# EAGLE design LinuxBoard_v1.6 (EAGLE 7.2.0)
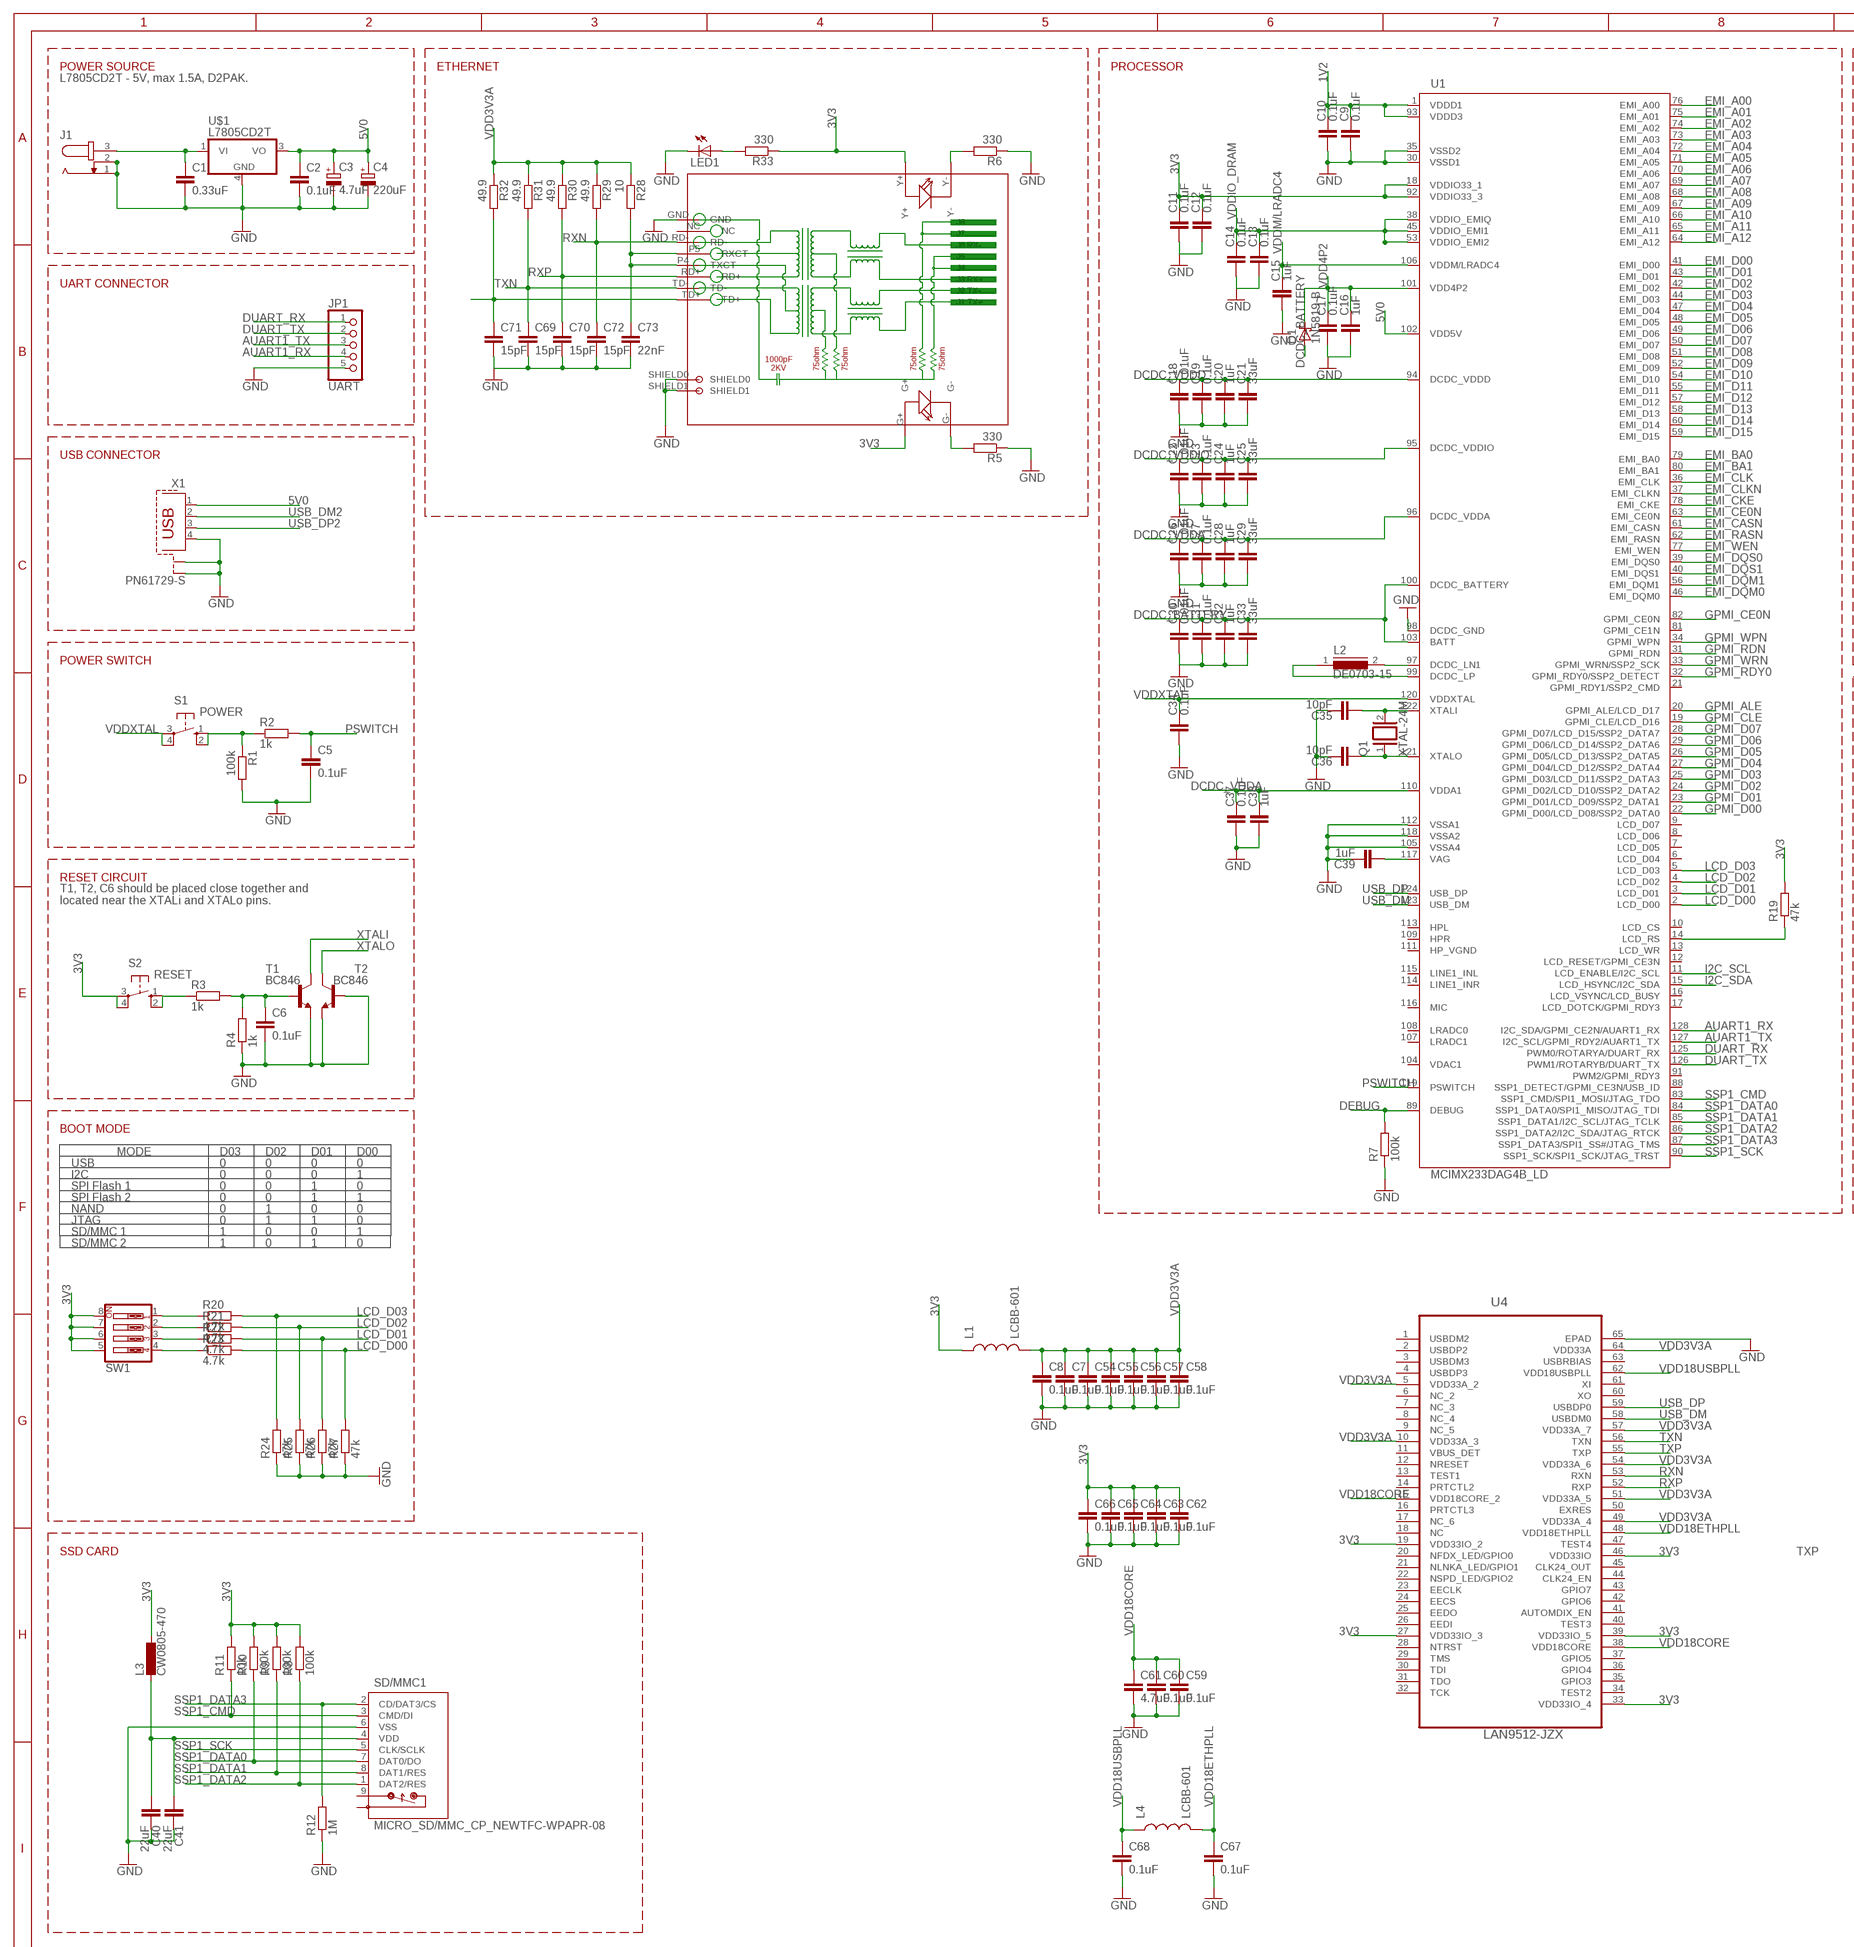
[diagram p0: schematic, sheet 1, part 1 of 2]
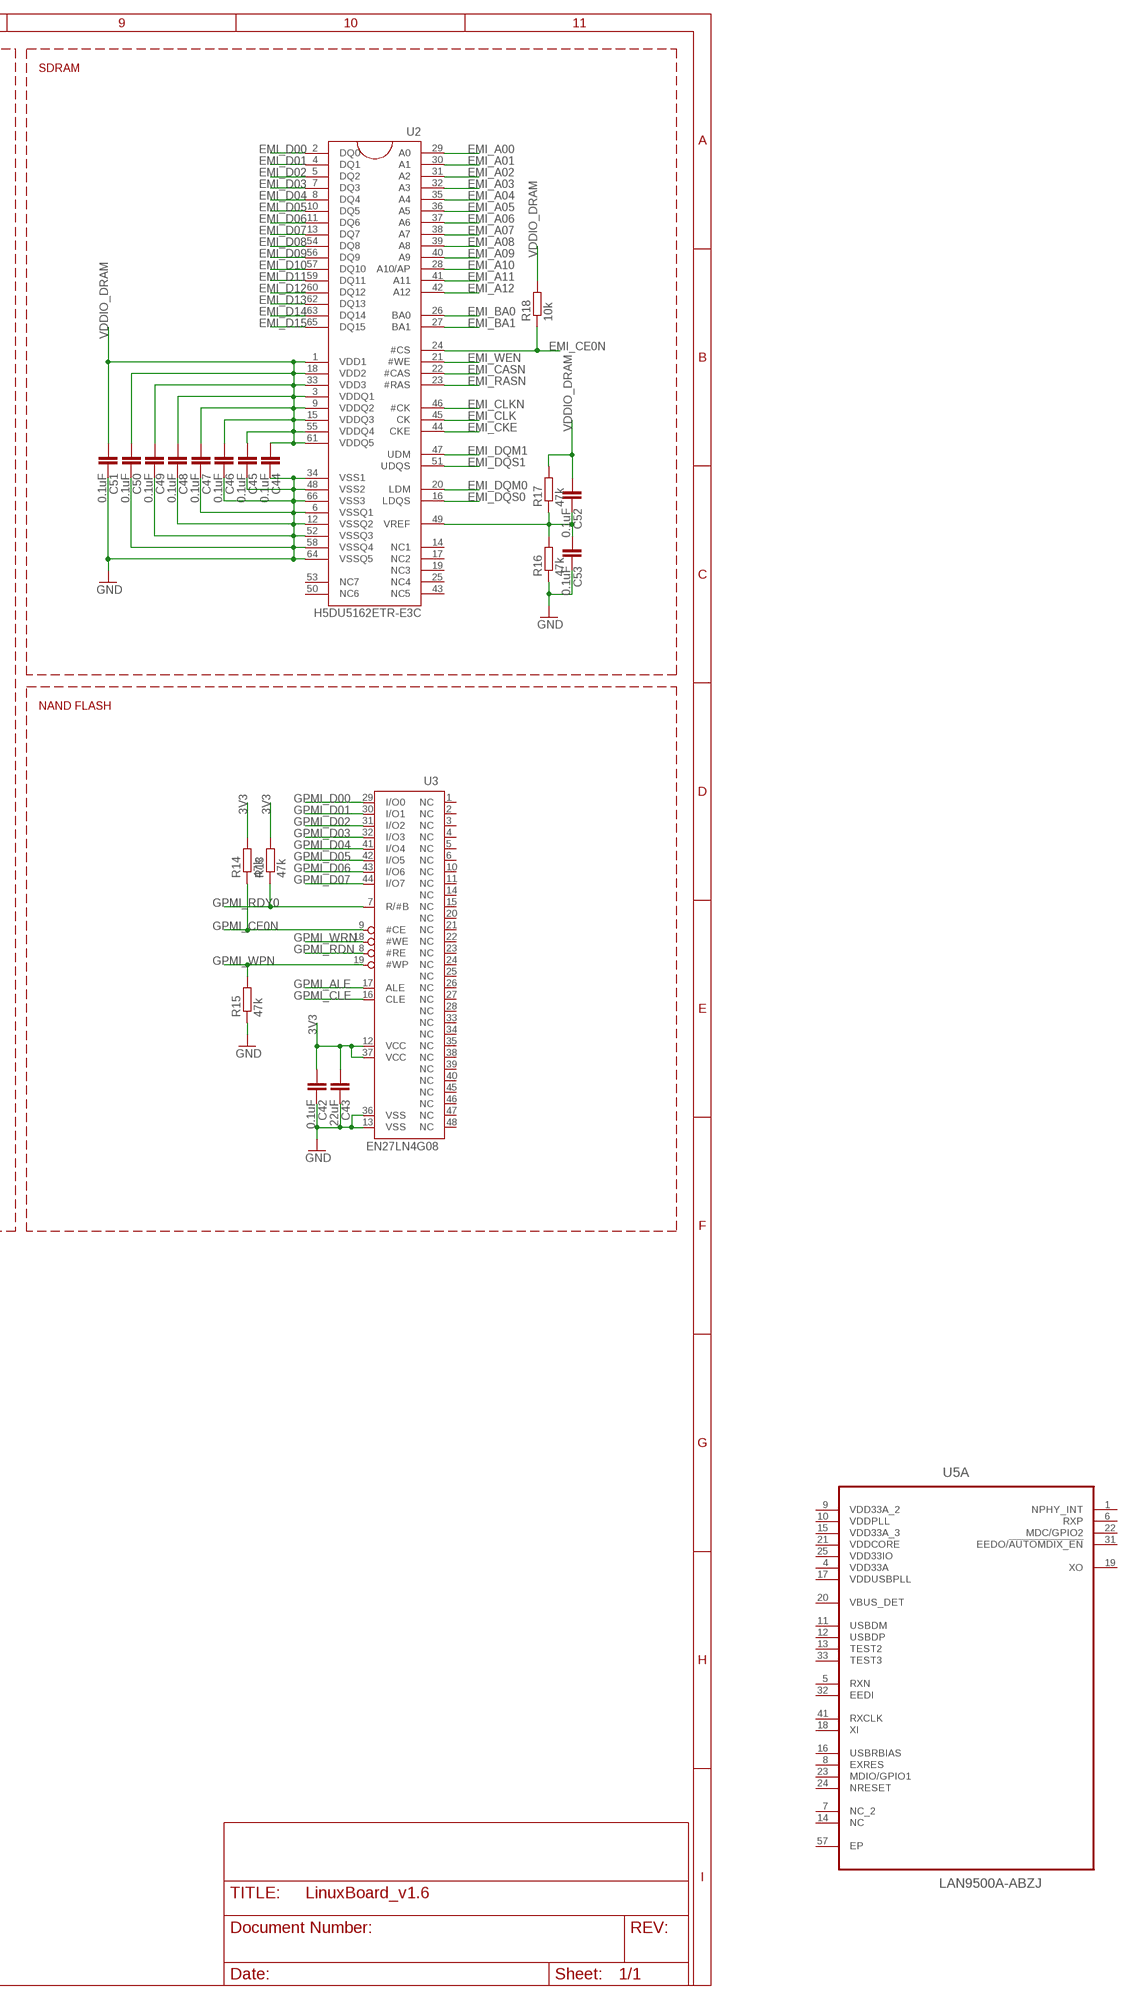
[diagram p1: schematic, sheet 1, part 2 of 2]

## Parts
C1  0.33uF  C-EUC0805  [C0805]
C2  0.1uF  C-EUC0805  [C0805]
C3  4.7uF  CPOL-EUE2-5  [E2-5]
C4  220uF  CPOL-EUE2-5  [E2-5]
C5  0.1uF  C-EUC0805  [C0805]
C6  0.1uF  C-EUC0805  [C0805]
C7  0.1uF  C-EUC0805  [C0805]
C8  0.1uF  C-EUC0805  [C0805]
C9  0.1uF  C-EUC0805  [C0805]
C10  0.1uF  C-EUC0805  [C0805]
C11  0.1uF  C-EUC0805  [C0805]
C12  0.1uF  C-EUC0805  [C0805]
C13  0.1uF  C-EUC0805  [C0805]
C14  0.1uF  C-EUC0805  [C0805]
C15  1uF  C-EUC0805  [C0805]
C16  1uF  C-EUC0805  [C0805]
C17  0.1uF  C-EUC0805  [C0805]
C18  0.01uF  C-EUC0805  [C0805]
C19  0.1uF  C-EUC0805  [C0805]
C20  1uF  C-EUC0805  [C0805]
C21  33uF  C-EUC0805  [C0805]
C22  0.01uF  C-EUC0805  [C0805]
C23  0.1uF  C-EUC0805  [C0805]
C24  1uF  C-EUC0805  [C0805]
C25  33uF  C-EUC0805  [C0805]
C26  0.01uF  C-EUC0805  [C0805]
C27  0.1uF  C-EUC0805  [C0805]
C28  1uF  C-EUC0805  [C0805]
C29  33uF  C-EUC0805  [C0805]
C30  0.01uF  C-EUC0805  [C0805]
C31  0.1uF  C-EUC0805  [C0805]
C32  1uF  C-EUC0805  [C0805]
C33  33uF  C-EUC0805  [C0805]
C34  0.1uF  C-EUC0805  [C0805]
C35  10pF  C-EUC0805  [C0805]
C36  10pF  C-EUC0805  [C0805]
C37  0.1uF  C-EUC0805  [C0805]
C38  1uF  C-EUC0805  [C0805]
C39  1uF  C-EUC0805  [C0805]
C40  22uF  C-EUC0805  [C0805]
C41  22uF  C-EUC0805  [C0805]
C42  0.1uF  C-EUC0805  [C0805]
C43  22uF  C-EUC0805  [C0805]
C44  0.1uF  C-EUC0805  [C0805]
C45  0.1uF  C-EUC0805  [C0805]
C46  0.1uF  C-EUC0805  [C0805]
C47  0.1uF  C-EUC0805  [C0805]
C48  0.1uF  C-EUC0805  [C0805]
C49  0.1uF  C-EUC0805  [C0805]
C50  0.1uF  C-EUC0805  [C0805]
C51  0.1uF  C-EUC0805  [C0805]
C52  0.1uF  C-EUC0805  [C0805]
C53  0.1uF  C-EUC0805  [C0805]
C54  0.1uF  C-EUC0805  [C0805]
C55  0.1uF  C-EUC0805  [C0805]
C56  0.1uF  C-EUC0805  [C0805]
C57  0.1uF  C-EUC0805  [C0805]
C58  0.1uF  C-EUC0805  [C0805]
C59  0.1uF  C-EUC0805  [C0805]
C60  0.1uF  C-EUC0805  [C0805]
C61  4.7uF  C-EUC0805  [C0805]
C62  0.1uF  C-EUC0805  [C0805]
C63  0.1uF  C-EUC0805  [C0805]
C64  0.1uF  C-EUC0805  [C0805]
C65  0.1uF  C-EUC0805  [C0805]
C66  0.1uF  C-EUC0805  [C0805]
C67  0.1uF  C-EUC0805  [C0805]
C68  0.1uF  C-EUC0805  [C0805]
C69  15pF  C-EUC0805  [C0805]
C70  15pF  C-EUC0805  [C0805]
C71  15pF  C-EUC0805  [C0805]
C72  15pF  C-EUC0805  [C0805]
C73  22nF  C-EUC0805  [C0805]
D1  1N5819-B  [DO41-7.6]
J1  JACK-PLUG0  [SPC4077]
JP1  UART  PINHD-1X5  [1X05]
L1  LCBB-601  INDUCTOR0805  [0805]
L2  DE0703-15  DR73  [DR73]
L3  CW0805-470  L-EUL2012C  [L2012C]
L4  LCBB-601  INDUCTOR0805  [0805]
LED1  LEDSML0805  [SML0805]
Q1  XTAL-24M  XTAL/S  [QS]
R1  100k  R-EU_R0805  [R0805]
R2  1k  R-EU_R0805  [R0805]
R3  1k  R-EU_R0805  [R0805]
R4  1k  R-EU_R0805  [R0805]
R5  330  R-EU_R0805  [R0805]
R6  330  R-EU_R0805  [R0805]
R7  100k  R-EU_R0805  [R0805]
R8  100k  R-EU_R0805  [R0805]
R9  100k  R-EU_R0805  [R0805]
R10  100k  R-EU_R0805  [R0805]
R11  10k  R-EU_R0805  [R0805]
R12  1M  R-EU_R0805  [R0805]
R13  47k  R-EU_R0805  [R0805]
R14  47k  R-EU_R0805  [R0805]
R15  47k  R-EU_R0805  [R0805]
R16  47k  R-EU_R0805  [R0805]
R17  47k  R-EU_R0805  [R0805]
R18  10k  R-EU_R0805  [R0805]
R19  47k  R-EU_R0805  [R0805]
R20  4.7k  R-EU_R0805  [R0805]
R21  4.7k  R-EU_R0805  [R0805]
R22  4.7k  R-EU_R0805  [R0805]
R23  4.7k  R-EU_R0805  [R0805]
R24  47k  R-EU_R0805  [R0805]
R25  47k  R-EU_R0805  [R0805]
R26  47k  R-EU_R0805  [R0805]
R27  47k  R-EU_R0805  [R0805]
R28  10  R-EU_R0805  [R0805]
R29  49.9  R-EU_R0805  [R0805]
R30  49.9  R-EU_R0805  [R0805]
R31  49.9  R-EU_R0805  [R0805]
R32  49.9  R-EU_R0805  [R0805]
R33  330  R-EU_R0805  [R0805]
RJ1  HR911105A  [HR911105A]
S1  POWER  10-XX  [B3F-10XX]
S2  RESET  10-XX  [B3F-10XX]
SD/MMC1  MICRO_SD/MMC_CP_NEWTFC-WPAPR-08  [TFC-WPAPR-08]
SW1  SW_DIP-4  [EDG-04]
T1  BC846  [SOT23]
T2  BC846  [SOT23]
U1  MCIMX233DAG4B_LD  [TQFP128LD]
U2  H5DU5162ETR-E3C  HY5DU121622D(L)T(P)-J  [66TSOP-II]
U3  EN27LN4G08  H27UBG8T2A  [TSOP48]
U4  LAN9512-JZX  [QFN50P900X900X100-65N]
U5  LAN9500A-ABZJ  [QFN50P800X800X100-57N]
U$1  L7805CD2T  [D2PAK-3]
X1  PN61729-S  [PN61729-S]

## Nets
1V2: C9.1 C10.1 U1.1(VDDD1) U1.93(VDDD3)
3V3: C11.1 C12.1 C42.2 C43.2 C62.1 C63.1 C64.1 C65.1 C66.1 L1.1 L3.1 R8.2 R9.2 R10.2 R11.2 R13.2 R14.2 R19.2 R33.1 RJ1.G+ RJ1.Y+ S2.3(P) S2.4(P1) SW1.5 SW1.6 SW1.7 SW1.8 U1.18(VDDIO33_1) U1.92(VDDIO33_3) U3.12(VCC) U3.37(VCC) U4.19(VDD33IO_2) U4.27(VDD33IO_3) U4.33(VDD33IO_4) U4.39(VDD33IO_5) U4.46(VDD33IO)
5V0: C2.1 C3.+ C4.+ U1.102(VDD5V) U$1.3(VO) X1.1
AUART1_RX: JP1.4 U1.128(I2C_SDA/GPMI_CE2N/AUART1_RX)
AUART1_TX: JP1.3 U1.127(I2C_SCL/GPMI_RDY2/AUART1_TX)
DCDC_BATTERY: C30.1 C31.1 C32.1 C33.1 D1.A U1.100(DCDC_BATTERY) U1.103(BATT)
DCDC_VDDA: C26.1 C27.1 C28.1 C29.1 C37.1 C38.1 U1.96(DCDC_VDDA) U1.110(VDDA1)
DCDC_VDDD: C18.1 C19.1 C20.1 C21.1 U1.94(DCDC_VDDD)
DCDC_VDDIO: C22.1 C23.1 C24.1 C25.1 U1.95(DCDC_VDDIO)
DEBUG: R7.2 U1.89(DEBUG)
DUART_RX: JP1.1 U1.125(PWM0/ROTARYA/DUART_RX)
DUART_TX: JP1.2 U1.126(PWM1/ROTARYB/DUART_TX)
EMI_A00: U1.76(EMI_A00) U2.29(A0)
EMI_A01: U1.75(EMI_A01) U2.30(A1)
EMI_A02: U1.74(EMI_A02) U2.31(A2)
EMI_A03: U1.73(EMI_A03) U2.32(A3)
EMI_A04: U1.72(EMI_A04) U2.35(A4)
EMI_A05: U1.71(EMI_A05) U2.36(A5)
EMI_A06: U1.70(EMI_A06) U2.37(A6)
EMI_A07: U1.69(EMI_A07) U2.38(A7)
EMI_A08: U1.68(EMI_A08) U2.39(A8)
EMI_A09: U1.67(EMI_A09) U2.40(A9)
EMI_A10: U1.66(EMI_A10) U2.28(A10/AP)
EMI_A11: U1.65(EMI_A11) U2.41(A11)
EMI_A12: U1.64(EMI_A12) U2.42(A12)
EMI_BA0: U1.79(EMI_BA0) U2.26(BA0)
EMI_BA1: U1.80(EMI_BA1) U2.27(BA1)
EMI_CASN: U1.61(EMI_CASN) U2.22(#CAS)
EMI_CE0N: R18.1 U1.63(EMI_CE0N) U2.24(#CS)
EMI_CKE: U1.78(EMI_CKE) U2.44(CKE)
EMI_CLK: U1.36(EMI_CLK) U2.45(CK)
EMI_CLKN: U1.37(EMI_CLKN) U2.46(#CK)
EMI_D00: U1.41(EMI_D00) U2.2(DQ0)
EMI_D01: U1.43(EMI_D01) U2.4(DQ1)
EMI_D02: U1.42(EMI_D02) U2.5(DQ2)
EMI_D03: U1.44(EMI_D03) U2.7(DQ3)
EMI_D04: U1.47(EMI_D04) U2.8(DQ4)
EMI_D05: U1.48(EMI_D05) U2.10(DQ5)
EMI_D06: U1.49(EMI_D06) U2.11(DQ6)
EMI_D07: U1.50(EMI_D07) U2.13(DQ7)
EMI_D08: U1.51(EMI_D08) U2.54(DQ8)
EMI_D09: U1.52(EMI_D09) U2.56(DQ9)
EMI_D10: U1.54(EMI_D10) U2.57(DQ10)
EMI_D11: U1.55(EMI_D11) U2.59(DQ11)
EMI_D12: U1.57(EMI_D12) U2.60(DQ12)
EMI_D13: U1.58(EMI_D13) U2.62(DQ13)
EMI_D14: U1.60(EMI_D14) U2.63(DQ14)
EMI_D15: U1.59(EMI_D15) U2.65(DQ15)
EMI_DQM0: U1.46(EMI_DQM0) U2.20(LDM)
EMI_DQM1: U1.56(EMI_DQM1) U2.47(UDM)
EMI_DQS0: U1.39(EMI_DQS0) U2.16(LDQS)
EMI_DQS1: U1.40(EMI_DQS1) U2.51(UDQS)
EMI_RASN: U1.62(EMI_RASN) U2.23(#RAS)
EMI_WEN: U1.77(EMI_WEN) U2.21(#WE)
GND: C1.2 C2.2 C3.- C4.- C5.2 C6.2 C7.2 C8.2 C9.2 C10.2 C11.2 C12.2 C13.2 C14.2 C15.2 C16.2 C17.2 C18.2 C19.2 C20.2 C21.2 C22.2 C23.2 C24.2 C25.2 C26.2 C27.2 C28.2 C29.2 C30.2 C31.2 C32.2 C33.2 C34.2 C35.1 C36.1 C37.2 C38.2 C39.1 C40.1 C41.1 C42.1 C43.1 C44.1 C45.1 C46.1 C47.1 C48.1 C49.1 C50.1 C51.1 C53.1 C54.2 C55.2 C56.2 C57.2 C58.2 C59.2 C60.2 C61.2 C62.2 C63.2 C64.2 C65.2 C66.2 C67.2 C68.2 C69.2 C70.2 C71.2 C72.2 C73.2 J1.1 J1.2 JP1.5 LED1.C R1.2 R4.1 R5.1 R6.1 R7.1 R12.1 R15.1 R16.1 R24.1 R25.1 R26.1 R27.1 RJ1.GND RJ1.SHIELD0 RJ1.SHIELD1 SD/MMC1.6(VSS) T1.2(E) T2.1(B) T2.2(E) U1.30(VSSD1) U1.35(VSSD2) U1.98(DCDC_GND) U1.105(VSSA4) U1.112(VSSA1) U1.118(VSSA2) U2.6(VSSQ1) U2.12(VSSQ2) U2.34(VSS1) U2.48(VSS2) U2.52(VSSQ3) U2.58(VSSQ4) U2.64(VSSQ5) U2.66(VSS3) U3.13(VSS) U3.36(VSS) U4.65(EPAD) U$1.4(GND) X1.4 X1.S1 X1.S2
GPMI_ALE: U1.20(GPMI_ALE/LCD_D17) U3.17(ALE)
GPMI_CE0N: R14.1 U1.82(GPMI_CE0N) U3.9(#CE)
GPMI_CLE: U1.19(GPMI_CLE/LCD_D16) U3.16(CLE)
GPMI_D00: U1.22(GPMI_D00/LCD_D08/SSP2_DATA0) U3.29(I/O0)
GPMI_D01: U1.23(GPMI_D01/LCD_D09/SSP2_DATA1) U3.30(I/O1)
GPMI_D02: U1.24(GPMI_D02/LCD_D10/SSP2_DATA2) U3.31(I/O2)
GPMI_D03: U1.25(GPMI_D03/LCD_D11/SSP2_DATA3) U3.32(I/O3)
GPMI_D04: U1.27(GPMI_D04/LCD_D12/SSP2_DATA4) U3.41(I/O4)
GPMI_D05: U1.26(GPMI_D05/LCD_D13/SSP2_DATA5) U3.42(I/O5)
GPMI_D06: U1.29(GPMI_D06/LCD_D14/SSP2_DATA6) U3.43(I/O6)
GPMI_D07: U1.28(GPMI_D07/LCD_D15/SSP2_DATA7) U3.44(I/O7)
GPMI_RDN: U1.31(GPMI_RDN) U3.8(#RE)
GPMI_RDY0: R13.1 U1.32(GPMI_RDY0/SSP2_DETECT) U3.7(R/#B)
GPMI_WPN: R15.2 U1.34(GPMI_WPN) U3.19(#WP)
GPMI_WRN: U1.33(GPMI_WRN/SSP2_SCK) U3.18(#WE)
I2C_SCL: U1.11(LCD_ENABLE/I2C_SCL)
I2C_SDA: U1.15(LCD_HSYNC/I2C_SDA)
LCD_D00: R23.2 R27.2 U1.2(LCD_D00)
LCD_D01: R22.2 R26.2 U1.3(LCD_D01)
LCD_D02: R21.2 R25.2 U1.4(LCD_D02)
LCD_D03: R20.2 R24.2 U1.5(LCD_D03)
N$1: C1.1 J1.3 U$1.1(VI)
N$2: R3.1 S2.1(S) S2.2(S1)
N$3: R1.1 R2.1 S1.1(S) S1.2(S1)
N$4: C6.1 R3.2 R4.2 T1.1(B)
N$5: R20.1 SW1.1
N$6: R21.1 SW1.2
N$7: R22.1 SW1.3
N$8: R23.1 SW1.4
N$9: L2.2 U1.97(DCDC_LN1)
N$10: R5.2 RJ1.G-
N$11: L2.1 U1.99(DCDC_LP)
N$12: C39.2 U1.117(VAG)
N$13: R19.1 U1.14(LCD_RS)
N$14: R6.2 RJ1.Y-
N$16: C40.2 C41.2 L3.2 SD/MMC1.4(VDD)
N$17: C73.1 R28.2 RJ1.P4(TXCT) RJ1.P5(RXCT)
N$18: LED1.A R33.2
N$26: C52.1 C53.2 R16.2 R17.1 U2.49(VREF)
PSWITCH: C5.1 R2.2 U1.119(PSWITCH)
RXN: C72.1 R29.2 RJ1.RD- U4.53(RXN)
RXP: C70.1 R30.2 RJ1.RD+ U4.52(RXP)
SSP1_CMD: R11.1 SD/MMC1.3(CMD/DI) U1.83(SSP1_CMD/SPI1_MOSI/JTAG_TDO)
SSP1_DATA0: R10.1 SD/MMC1.7(DAT0/DO) U1.84(SSP1_DATA0/SPI1_MISO/JTAG_TDI)
SSP1_DATA1: R9.1 SD/MMC1.8(DAT1/RES) U1.85(SSP1_DATA1/I2C_SCL/JTAG_TCLK)
SSP1_DATA2: R8.1 SD/MMC1.1(DAT2/RES) U1.86(SSP1_DATA2/I2C_SDA/JTAG_RTCK)
SSP1_DATA3: R12.2 SD/MMC1.2(CD/DAT3/CS) U1.87(SSP1_DATA3/SPI1_SS#/JTAG_TMS)
SSP1_SCK: SD/MMC1.5(CLK/SCLK) U1.90(SSP1_SCK/SPI1_SCK/JTAG_TRST)
TXN: C69.1 R31.2 RJ1.TD- U4.56(TXN)
TXP: C71.1 R32.2 RJ1.TD+ U4.55(TXP)
USB_DM: U1.123(USB_DM) U4.58(USBDM0)
USB_DM2: X1.2
USB_DP: U1.124(USB_DP) U4.59(USBDP0)
USB_DP2: X1.3
VDD3V3A: C7.1 C8.1 C54.1 C55.1 C56.1 C57.1 C58.1 L1.2 R28.1 R29.1 R30.1 R31.1 R32.1 U4.5(VDD33A_2) U4.10(VDD33A_3) U4.49(VDD33A_4) U4.51(VDD33A_5) U4.54(VDD33A_6) U4.57(VDD33A_7) U4.64(VDD33A)
VDD4P2: C16.1 C17.1 D1.C U1.101(VDD4P2)
VDD18CORE: C59.1 C60.1 C61.1 U4.15(VDD18CORE_2) U4.38(VDD18CORE)
VDD18ETHPLL: C67.1 L4.2 U4.48(VDD18ETHPLL)
VDD18USBPLL: C68.1 L4.1 U4.62(VDD18USBPLL)
VDDIO_DRAM: C13.1 C14.1 C44.2 C45.2 C46.2 C47.2 C48.2 C49.2 C50.2 C51.2 C52.2 R17.2 R18.2 U1.38(VDDIO_EMIQ) U1.45(VDDIO_EMI1) U1.53(VDDIO_EMI2) U2.1(VDD1) U2.3(VDDQ1) U2.9(VDDQ2) U2.15(VDDQ3) U2.18(VDD2) U2.33(VDD3) U2.55(VDDQ4) U2.61(VDDQ5)
VDDM/LRADC4: C15.1 U1.106(VDDM/LRADC4)
VDDXTAL: C34.1 S1.3(P) S1.4(P1) U1.120(VDDXTAL)
XTALI: C35.2 Q1.2 T1.3(C) U1.122(XTALI)
XTALO: C36.2 Q1.1 T2.3(C) U1.121(XTALO)
Unconnected: RJ1.NC SD/MMC1.9(CP_E) SD/MMC1.10(PACK1) U1.6(LCD_D04) U1.7(LCD_D05) U1.8(LCD_D06) U1.9(LCD_D07) U1.10(LCD_CS) U1.12(LCD_RESET/GPMI_CE3N) U1.13(LCD_WR) U1.16(LCD_VSYNC/LCD_BUSY) U1.17(LCD_DOTCK/GPMI_RDY3) U1.21(GPMI_RDY1/SSP2_CMD) U1.81(GPMI_CE1N) U1.88(SSP1_DETECT/GPMI_CE3N/USB_ID) U1.91(PWM2/GPMI_RDY3) U1.104(VDAC1) U1.107(LRADC1) U1.108(LRADC0) U1.109(HPR) U1.113(HPL) U1.114(LINE1_INR) U1.115(LINE1_INL) U1.116(MIC) U2.14(NC1) U2.17(NC2) U2.19(NC3) U2.25(NC4) U2.43(NC5) U2.50(NC6) U2.53(NC7) U3.1(NC) U3.2(NC) U3.3(NC) U3.4(NC) U3.5(NC) U3.6(NC) U3.10(NC) U3.11(NC) U3.14(NC) U3.15(NC) U3.20(NC) U3.21(NC) U3.22(NC) U3.23(NC) U3.24(NC) U3.25(NC) U3.26(NC) U3.27(NC) U3.28(NC) U3.33(NC) U3.34(NC) U3.35(NC) U3.38(NC) U3.39(NC) U3.40(NC) U3.45(NC) U3.46(NC) U3.47(NC) U3.48(NC) U4.1(USBDM2) U4.2(USBDP2) U4.3(USBDM3) U4.4(USBDP3) U4.6(NC_2) U4.7(NC_3) U4.8(NC_4) U4.9(NC_5) U4.12(NRESET) U4.13(TEST1) U4.14(PRTCTL2) U4.16(PRTCTL3) U4.17(NC_6) U4.18(NC) U4.20(NFDX_LED/GPIO0) U4.21(NLNKA_LED/GPIO1) U4.22(NSPD_LED/GPIO2) U4.23(EECLK) U4.24(EECS) U4.25(EEDO) U4.26(EEDI) U4.28(NTRST) U4.29(TMS) U4.30(TDI) U4.31(TDO) U4.32(TCK) U4.34(TEST2) U4.35(GPIO3) U4.36(GPIO4) U4.37(GPIO5) U4.40(TEST3) U4.41(AUTOMDIX_EN) U4.42(GPIO6) U4.43(GPIO7) U4.44(CLK24_EN) U4.45(CLK24_OUT) U4.47(TEST4) U4.50(EXRES) U4.60(XO) U4.61(XI) U4.63(USBRBIAS) U5.1(A:NPHY_INT) U5.2(B:TXN) U5.3(B:TXP) U5.5(A:RXN) U5.6(A:RXP) U5.7(A:NC_2) U5.8(A:EXRES) U5.11(A:USBDM) U5.12(A:USBDP) U5.14(A:NC) U5.16(A:USBRBIAS) U5.18(A:XI) U5.19(A:XO) U5.21(A:VDDCORE) U5.22(A:MDC/GPIO2) U5.23(A:MDIO/GPIO1) U5.24(A:NRESET) U5.26(B:NFDX_LED/GPIO8) U5.27(B:NLNKA_LED/GPIO9) U5.28(B:NSPD_LED/GPIO10) U5.29(B:EECLK/!PWR_SEL) U5.30(B:EECS) U5.31(A:EEDO/!AUTOMDIX_EN) U5.32(A:EEDI) U5.34(B:PHY_SEL) U5.36(B:NTRST/RXD0) U5.37(B:TDO/NPHY_RST) U5.38(B:TCK/RXD1) U5.39(B:TMS/RXD2) U5.40(B:TDI/RXD3) U5.41(A:RXCLK) U5.42(B:RXDV) U5.43(B:TXEN) U5.44(B:RXER) U5.45(B:CRS/GPIO3) U5.46(B:COL/GPIO0) U5.47(B:TXCLK) U5.53(B:TXD3/GPIO7/!EEP_SIZE) U5.54(B:TXD2/GPIO6/!PORT_SWAP) U5.55(B:TXD1/GPIO5/!RMT_WKP) U5.56(B:TXD0/GPIO4/!EEP_DISABLE) U5.57(A:EP)

## Notes on the sheet
- POWER SOURCE | ETHERNET | PROCESSOR | SDRAM
- L7805CD2T - 5V, max 1.5A, D2PAK.
- UART CONNECTOR
- USB CONNECTOR
- POWER SWITCH
- NAND FLASH
- RESET CIRCUIT
- T1, T2, C6 should be placed close together and
  located near the XTALi and XTALo pins.
- BOOT MODE
- MODE | D03 | D02 | D01 | D00
- USB | 0 | 0 | 0 | 0
- I2C | 0 | 0 | 0 | 1
- SPI Flash 1 | 0 | 0 | 1 | 0
- SPI Flash 2 | 0 | 0 | 1 | 1
- NAND | 0 | 1 | 0 | 0
- JTAG | 0 | 1 | 1 | 0
- SD/MMC 1 | 1 | 0 | 0 | 1
- SD/MMC 2 | 1 | 0 | 1 | 0
- SSD CARD

## Power pins joined to a net without a drawn wire
HP_VGND: U1.111(HP_VGND)
TEST1: U5.49(B:TEST1)
TEST2: U5.13(A:TEST2)
TEST3: U5.33(A:TEST3)
VBUS_DET: U4.11(VBUS_DET) U5.20(A:VBUS_DET)
VDD3V3A: U5.4(A:VDD33A)
VDD33A_2: U5.9(A:VDD33A_2)
VDD33A_3: U5.15(A:VDD33A_3)
VDD33IO: U5.25(A:VDD33IO) U5.52(B:VDD33IO)
VDD33IO_2: U5.48(B:VDD33IO_2)
VDD33IO_3: U5.51(B:VDD33IO_3)
VDD33IO_4: U5.35(B:VDD33IO_4)
VDDCORE: U5.50(B:VDDCORE)
VDDPLL: U5.10(A:VDDPLL)
VDDUSBPLL: U5.17(A:VDDUSBPLL)

## Library data of the parts
C1 C2 C5-C73 = rcl:C-EU: CAPACITOR, European symbol
C3 C4 = rcl:CPOL-EU: POLARIZED CAPACITOR, European symbol
D1 = diode:1N581*: 1.0A SCHOTTKY BARRIER RECTIFIER Source: http://www.diodes.com/datasheets/ds23001.pdf
J1 = con-jack:JACK-PLUG: DC POWER JACK Power Jack, DC, Right Angle, Through Hole, Rated 5A at 16VDC, PC Terminals Distributor: Farnell (www.Farnell.de) Drawing: 84N1161.pdf / 84N1162.pdf Manufacturer: SPC Technology (www.spctechnology.com) Type: SPC4077 / SPC 4078; OC_FARNELL: unknown; OC_NEWARK: unknown
JP1 = pinhead:PINHD-1X5: PIN HEADER
L1 L4 = SparkFun-Passives:INDUCTOR: Inductors Basic Inductor/Choke - 0603 and 1206. Footprints are not proven and vary greatly between part numbers. SRN6045- 33uH, 20% 1.4A SDR0403-560KL - 56uH, 10%, 500mA RMS/740mA peak
L2 = inductors:DR73: High Power Density, High Efficiency, Shielded Inductors Source: coiltronics_dr_series.pdf
L3 = rcl:L-EU: INDUCTOR, European symbol
LED1 = led:LED: LED OSRAM: - CHIPLED LG R971, LG N971, LY N971, LG Q971, LY Q971, LO R971, LY R971 LH N974, LH R974 LS Q976, LO Q976, LY Q976 LO Q996 - Hyper CHIPLED LW Q18S LB Q993, LB Q99A, LB R99A - SideLED LS A670, LO A670, LY A670, LG A670, LP A670 LB A673, LV A673, LT A673, LW A673 LH A674 LY A675 LS A676, LA A676, LO A676, LY A676, LW A676 LS A679, LY A679, LG A679 - Hyper Micro SIDELED® LS Y876, LA Y876, LO Y876, LY Y876 LT Y87S - SmartLED LW L88C, LW L88S LB L89C, LB L89S, LG L890 LS L89K, LO L89K, LY L89K LS L896, LA L896, LO L896, LY L896 - TOPLED LS T670, LO T670, LY T670, LG T670, LP T670 LSG T670, LSP T670, LSY T670, LOP T670, LYG T670 LG T671, LOG T671, LSG T671 LB T673, LV T673, LT T673, LW T673 LH T674 LS T676, LA T676, LO T676, LY T676, LB T676, LH T676, LSB T676, LW T676 LB T67C, LV T67C, LT T67C, LS T67K, LO T67K, LY T67K, LW E67C LS E67B, LA E67B, LO E67B, LY E67B, LB E67C, LV E67C, LT E67C LW T67C LS T679, LY T679, LG T679 LS T770, LO T770, LY T770, LG T770, LP T770 LB T773, LV T773, LT T773, LW T773 LH T774 LS E675, LA E675, LY E675, LS T675 LS T776, LA T776, LO T776, LY T776, LB T776 LHGB T686 LT T68C, LB T68C - Hyper Mini TOPLED® LB M676 - Mini TOPLED Santana® LG M470 LS M47K, LO M47K, LY M47K Source: http://www.osram.convergy.de LUXEON: - LUMILED® LXK2-PW12-R00, LXK2-PW12-S00, LXK2-PW14-U00, LXK2-PW14-V00 LXK2-PM12-R00, LXK2-PM12-S00, LXK2-PM14-U00 LXK2-PE12-Q00, LXK2-PE12-R00, LXK2-PE12-S00, LXK2-PE14-T00, LXK2-PE14-U00 LXK2-PB12-K00, LXK2-PB12-L00, LXK2-PB12-M00, LXK2-PB14-N00, LXK2-PB14-P00, LXK2-PB14-Q00 LXK2-PR12-L00, LXK2-PR12-M00, LXK2-PR14-Q00, LXK2-PR14-R00 LXK2-PD12-Q00, LXK2-PD12-R00, LXK2-PD12-S00 LXK2-PH12-R00, LXK2-PH12-S00 LXK2-PL12-P00, LXK2-PL12-Q00, LXK2-PL12-R00 Source: www.luxeon.com KINGBRIGHT: KA-3528ASYC Source: www.kingbright.com
Q1 = special:XTAL/S: CRYSTAL
R1-R33 = rcl:R-EU_: RESISTOR, European symbol
RJ1 = CONNECTER:HR911105A
S1 S2 = switch-omron:10-XX: OMRON SWITCH; MPN: B3F-1000; OC_FARNELL: 176432; OC_NEWARK: 36M3542
SD/MMC1 = A13-OLinuXino_WIFI_Rev_G:MICRO_SD/MMC_CP_NEW
SW1 = special:SW_DIP-4: DIP SWITCH
T1 T2 = transistor:BC846: NPN TRANSISTOR
U1 = hosho:MCIMX233DAG4B: i.MX23
U2 = iMX233-OLinuXino-Micro_Rev_D:HY5DU121622D(L)T(P)
U3 = A13-OLinuXino_WIFI_Rev_G:H27UBG8T2A
U4 = hosho:LAN9512-JZX: IC, USB2 - ENET CNTRL 2-PORT HUB, 64VQFN; MPN: LAN9512-JZX; OC_FARNELL: 2292586; OC_NEWARK: 66W1988; PACKAGE: 64VQFN; SUPPLIER: Microchip
U5 = hosho:LAN9500A-ABZJ: Ethernet Controller,56VQFN; MPN: LAN9500A-ABZJ; OC_FARNELL: 2292585; OC_NEWARK: 66W1987; PACKAGE: 56VQFN; SUPPLIER: MICROCHIP
U$1 = hosho:L7805CD2T
X1 = con-berg:PN61729-S: BERG USB connector; OC_FARNELL: unknown; OC_NEWARK: unknown

## Net classes
1 pwr: width 0.5 mm, clearance 0.2 mm

## Board
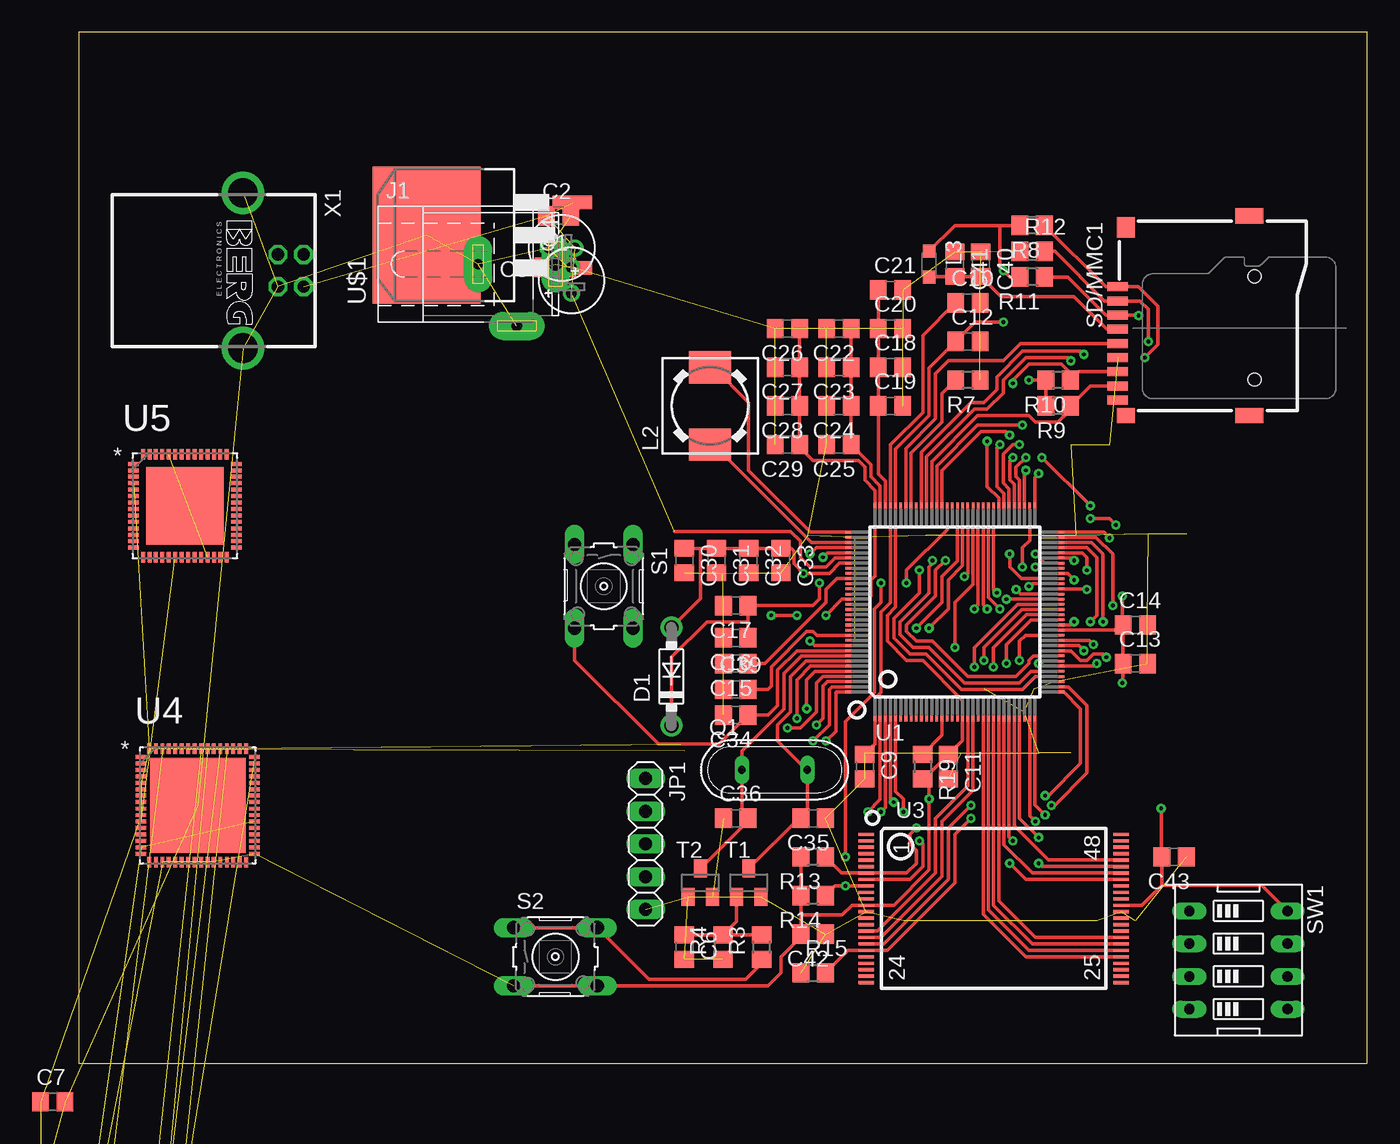
[diagram p2: board, top side]
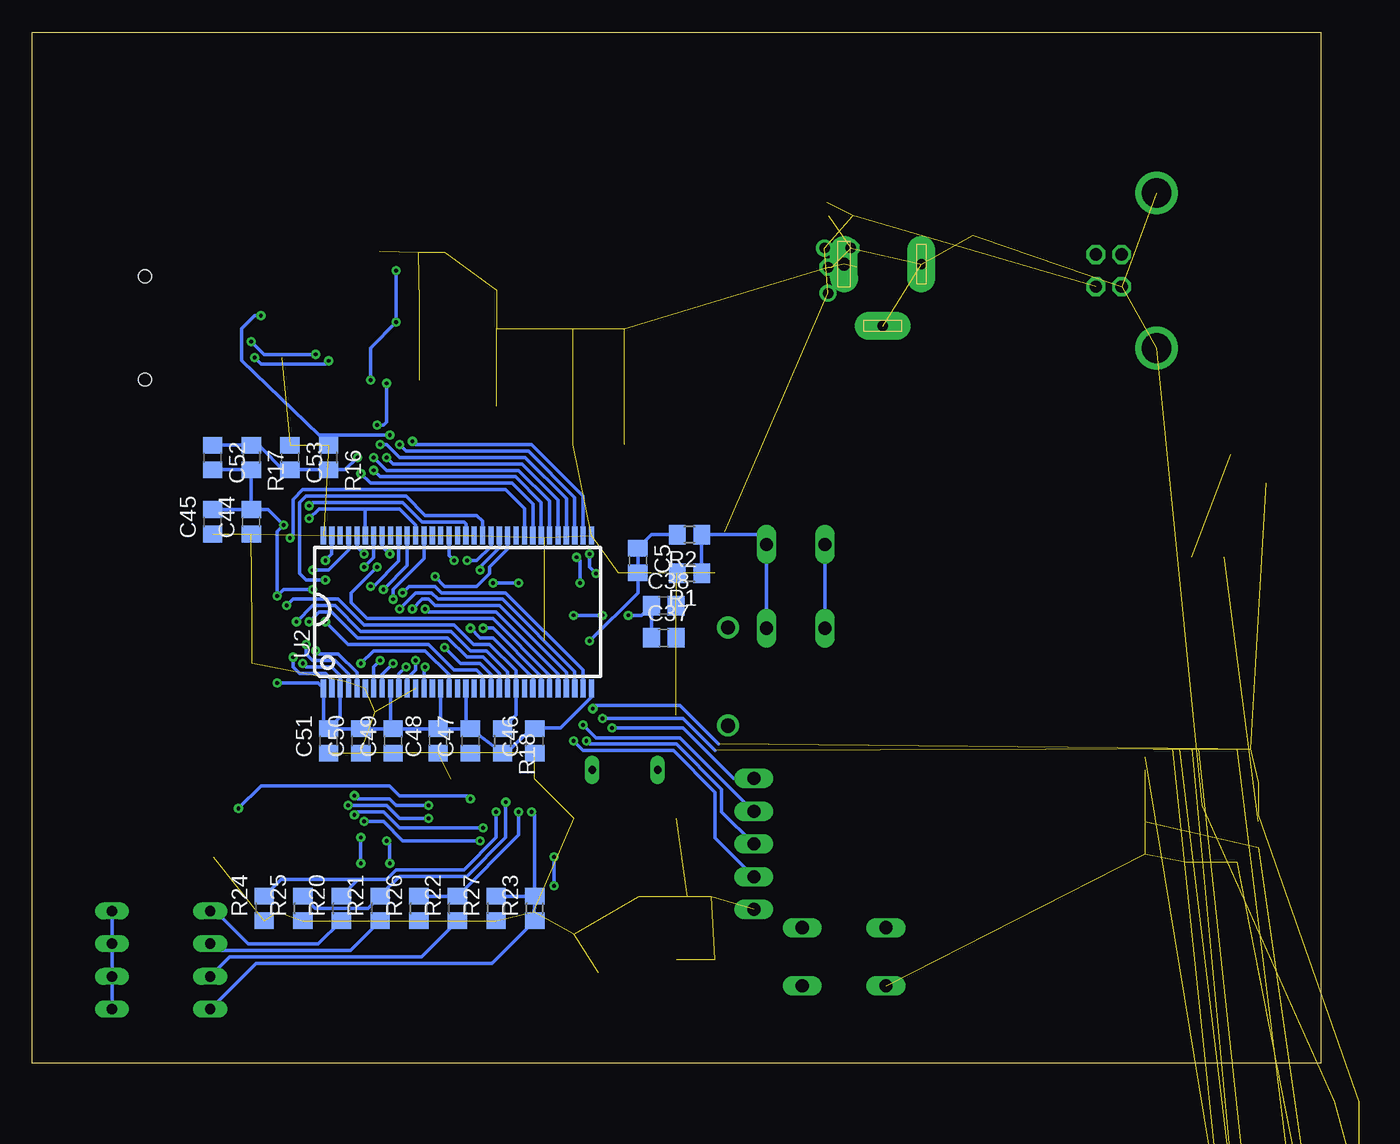
[diagram p3: board, bottom side, seen from below]

Size 100 x 80 mm. Coordinates in mm from the lower left corner, seen from the top.
Outline: 0,0 100,0 100,80 0,80 0,0
Copper layers (1*16): Top 0.035mm / dielectric 1.5mm / Bottom 0.035mm
Design rules "default *": minimum track width 10mil, minimum drill 24mil, track to track 8mil, track to pad 8mil, pad to pad 8mil, via to via 8mil, smd to smd 8mil, copper to edge 40mil, drill to drill 8mil, minimum pad ring 10mil, minimum via ring 8mil, stop-mask expansion 4mil, vias tented up to drill 12mil, thermal gap 10mil

### Footprints (pad centres in the part's own frame; a part is rotated, then mirrored left to right if it is on the bottom)
C0805 = smd 1.3 x 1.5: 1 -0.95,0; 2 0.95,0
E2-5 = drill 0.813 pad 1.27: + -1.016,0 | drill 0.813 pad 1.27 octagon: - 1.016,0
DO41-7.6 = drill 1.1 pad 1.7: A 3.81,0; C -3.81,0
SPC4077 = drill 0.8 pad 2.184 long: 1 -3,0; 2 0,-4.8 | drill 1 pad 2.184 long: 3 3,0
1X05 = drill 1.016 long: 1 -5.08,0; 2 -2.54,0; 3 0,0; 4 2.54,0; 5 5.08,0
0805 = smd 0.8 x 1.2: 1 -0.9,0; 2 0.9,0
DR73 = smd 2.5 x 3.25: 1 -3,0; 2 3,0
L2012C = smd 1 x 1: 1 -1,0; 2 1,0
SML0805 = smd 1.2 x 1.2: A 1.05,0; C -1.05,0
QS = drill 0.61 long: 1 -2.54,0; 2 2.54,0
R0805 = smd 1.3 x 1.5: 1 -0.95,0; 2 0.95,0
HR911105A = drill 0.813 pad 1.524: G+ 4.953,-6.604; G- 4.953,-4.064; GND -8.89,4.445; NC -6.35,3.175; P4 -8.89,-0.635; P5 -6.35,0.635; RD+ -6.35,-1.905; RD- -8.89,1.905; TD- -8.89,-3.175; Y+ 4.953,6.604; Y- 4.953,4.064 | drill 1.651 pad 2.159: SHIELD0 -2.921,8.001; SHIELD1 -2.921,-8.001 | drill 0.813 pad 1.524 square: TD+ -6.35,-4.445 | hole 3.556: 0,-5.715; 0,5.715
B3F-10XX = drill 1.016 long: 1 -3.251,2.261; 2 3.251,2.261; 3 -3.251,-2.261; 4 3.251,-2.261
TFC-WPAPR-08 = smd 1.6 x 0.7: 1 -7.375,2.25; 2 -7.375,1.15; 3 -7.375,0.05; 4 -7.375,-1.05; 5 -7.375,-2.15; 6 -7.375,-3.25; 7 -7.375,-4.35; 8 -7.375,-5.45; 9 -7.375,-6.55 | smd 1.4 x 1.2: 10 -6.75,-7.75 | smd 1.4 x 1.6: 11 -6.75,6.85 | smd 2.2 x 1.2: 12 2.85,-7.75; 13 2.85,7.75 | hole 1: 3.25,-4.95; 3.25,3.05
EDG-04 = drill 0.813 long: 1 -3.81,-3.81; 2 -1.27,-3.81; 3 1.27,-3.81; 4 3.81,-3.81; 5 3.81,3.81; 6 1.27,3.81; 7 -1.27,3.81; 8 -3.81,3.81
SOT23 = smd 1 x 1.4: 1 -0.95,-1.1; 2 0.95,-1.1; 3 0,1.1
TQFP128LD = smd 0.2 x 1.5: 1 -6.2,-7.75; 2 -5.8,-7.75; 3 -5.4,-7.75; 4 -5,-7.75; 5 -4.6,-7.75; 6 -4.2,-7.75; 7 -3.8,-7.75; 8 -3.4,-7.75; 9 -3,-7.75; 10 -2.6,-7.75; 11 -2.2,-7.75; 12 -1.8,-7.75; 13 -1.4,-7.75; 14 -1,-7.75; 15 -0.6,-7.75; 16 -0.2,-7.75; 17 0.2,-7.75; 18 0.6,-7.75; 19 1,-7.75; 20 1.4,-7.75; 21 1.8,-7.75; 22 2.2,-7.75; 23 2.6,-7.75; 24 3,-7.75; 25 3.4,-7.75; 26 3.8,-7.75; 27 4.2,-7.75; 28 4.6,-7.75; 29 5,-7.75; 30 5.4,-7.75; 31 5.8,-7.75; 32 6.2,-7.75; 65 6.2,7.75; 66 5.8,7.75; 67 5.4,7.75; 68 5,7.75; 69 4.6,7.75; 70 4.2,7.75; 71 3.8,7.75; 72 3.4,7.75; 73 3,7.75; 74 2.6,7.75; 75 2.2,7.75; 76 1.8,7.75; 77 1.4,7.75; 78 1,7.75; 79 0.6,7.75; 80 0.2,7.75; 81 -0.2,7.75; 82 -0.6,7.75; 83 -1,7.75; 84 -1.4,7.75; 85 -1.8,7.75; 86 -2.2,7.75; 87 -2.6,7.75; 88 -3,7.75; 89 -3.4,7.75; 90 -3.8,7.75; 91 -4.2,7.75; 92 -4.6,7.75; 93 -5,7.75; 94 -5.4,7.75; 95 -5.8,7.75; 96 -6.2,7.75 | smd 1.5 x 0.2: 33 7.75,-6.2; 34 7.75,-5.8; 35 7.75,-5.4; 36 7.75,-5; 37 7.75,-4.6; 38 7.75,-4.2; 39 7.75,-3.8; 40 7.75,-3.4; 41 7.75,-3; 42 7.75,-2.6; 43 7.75,-2.2; 44 7.75,-1.8; 45 7.75,-1.4; 46 7.75,-1; 47 7.75,-0.6; 48 7.75,-0.2; 49 7.75,0.2; 50 7.75,0.6; 51 7.75,1; 52 7.75,1.4; 53 7.75,1.8; 54 7.75,2.2; 55 7.75,2.6; 56 7.75,3; 57 7.75,3.4; 58 7.75,3.8; 59 7.75,4.2; 60 7.75,4.6; 61 7.75,5; 62 7.75,5.4; 63 7.75,5.8; 64 7.75,6.2; 97 -7.75,6.2; 98 -7.75,5.8; 99 -7.75,5.4; 100 -7.75,5; 101 -7.75,4.6; 102 -7.75,4.2; 103 -7.75,3.8; 104 -7.75,3.4; 105 -7.75,3; 106 -7.75,2.6; 107 -7.75,2.2; 108 -7.75,1.8; 109 -7.75,1.4; 110 -7.75,1; 111 -7.75,0.6; 112 -7.75,0.2; 113 -7.75,-0.2; 114 -7.75,-0.6; 115 -7.75,-1; 116 -7.75,-1.4; 117 -7.75,-1.8; 118 -7.75,-2.2; 119 -7.75,-2.6; 120 -7.75,-3; 121 -7.75,-3.4; 122 -7.75,-3.8; 123 -7.75,-4.2; 124 -7.75,-4.6; 125 -7.75,-5; 126 -7.75,-5.4; 127 -7.75,-5.8; 128 -7.75,-6.2
66TSOP-II = smd 0.4 x 1.4: 1 -10.4,-5.925; 2 -9.75,-5.925; 3 -9.1,-5.925; 4 -8.45,-5.925; 5 -7.8,-5.925; 6 -7.15,-5.925; 7 -6.5,-5.925; 8 -5.85,-5.925; 9 -5.2,-5.925; 10 -4.55,-5.925; 11 -3.9,-5.925; 12 -3.25,-5.925; 13 -2.6,-5.925; 14 -1.95,-5.925; 15 -1.3,-5.925; 16 -0.65,-5.925; 17 0,-5.925; 18 0.65,-5.925; 19 1.3,-5.925; 20 1.95,-5.925; 21 2.6,-5.925; 22 3.25,-5.925; 23 3.9,-5.925; 24 4.55,-5.925; 25 5.2,-5.925; 26 5.85,-5.925; 27 6.5,-5.925; 28 7.15,-5.925; 29 7.8,-5.925; 30 8.45,-5.925; 31 9.1,-5.925; 32 9.75,-5.925; 33 10.4,-5.925; 34 10.4,5.925; 35 9.75,5.925; 36 9.1,5.925; 37 8.45,5.925; 38 7.8,5.925; 39 7.15,5.925; 40 6.5,5.925; 41 5.85,5.925; 42 5.2,5.925; 43 4.55,5.925; 44 3.9,5.925; 45 3.25,5.925; 46 2.6,5.925; 47 1.95,5.925; 48 1.3,5.925; 49 0.65,5.925; 50 0,5.925; 51 -0.65,5.925; 52 -1.3,5.925; 53 -1.95,5.925; 54 -2.6,5.925; 55 -3.25,5.925; 56 -3.9,5.925; 57 -4.55,5.925; 58 -5.2,5.925; 59 -5.85,5.925; 60 -6.5,5.925; 61 -7.15,5.925; 62 -7.8,5.925; 63 -8.45,5.925; 64 -9.1,5.925; 65 -9.75,5.925; 66 -10.4,5.925
TSOP48 = smd 1.2 x 0.25: 1 -9.9,5.75; 2 -9.9,5.25; 3 -9.9,4.75; 4 -9.9,4.25; 5 -9.9,3.75; 6 -9.9,3.25; 7 -9.9,2.75; 8 -9.9,2.25; 9 -9.9,1.75; 10 -9.9,1.25; 11 -9.9,0.75; 12 -9.9,0.25; 13 -9.9,-0.25; 14 -9.9,-0.75; 15 -9.9,-1.25; 16 -9.9,-1.75; 17 -9.9,-2.25; 18 -9.9,-2.75; 19 -9.9,-3.25; 20 -9.9,-3.75; 21 -9.9,-4.25; 22 -9.9,-4.75; 23 -9.9,-5.25; 24 -9.9,-5.75; 25 9.9,-5.75; 26 9.9,-5.25; 27 9.9,-4.75; 28 9.9,-4.25; 29 9.9,-3.75; 30 9.9,-3.25; 31 9.9,-2.75; 32 9.9,-2.25; 33 9.9,-1.75; 34 9.9,-1.25; 35 9.9,-0.75; 36 9.9,-0.25; 37 9.9,0.25; 38 9.9,0.75; 39 9.9,1.25; 40 9.9,1.75; 41 9.9,2.25; 42 9.9,2.75; 43 9.9,3.25; 44 9.9,3.75; 45 9.9,4.25; 46 9.9,4.75; 47 9.9,5.25; 48 9.9,5.75
QFN50P900X900X100-65N = smd 0.813 x 0.305: 1 -4.394,3.759; 2 -4.394,3.251; 3 -4.394,2.743; 4 -4.394,2.261; 5 -4.394,1.753; 6 -4.394,1.245; 7 -4.394,0.762; 8 -4.394,0.254; 9 -4.394,-0.254; 10 -4.394,-0.762; 11 -4.394,-1.245; 12 -4.394,-1.753; 13 -4.394,-2.261; 14 -4.394,-2.743; 15 -4.394,-3.251; 16 -4.394,-3.759; 33 4.394,-3.759; 34 4.394,-3.251; 35 4.394,-2.743; 36 4.394,-2.261; 37 4.394,-1.753; 38 4.394,-1.245; 39 4.394,-0.762; 40 4.394,-0.254; 41 4.394,0.254; 42 4.394,0.762; 43 4.394,1.245; 44 4.394,1.753; 45 4.394,2.261; 46 4.394,2.743; 47 4.394,3.251; 48 4.394,3.759 | smd 0.305 x 0.813: 17 -3.759,-4.394; 18 -3.251,-4.394; 19 -2.743,-4.394; 20 -2.261,-4.394; 21 -1.753,-4.394; 22 -1.245,-4.394; 23 -0.762,-4.394; 24 -0.254,-4.394; 25 0.254,-4.394; 26 0.762,-4.394; 27 1.245,-4.394; 28 1.753,-4.394; 29 2.261,-4.394; 30 2.743,-4.394; 31 3.251,-4.394; 32 3.759,-4.394; 49 3.759,4.394; 50 3.251,4.394; 51 2.743,4.394; 52 2.261,4.394; 53 1.753,4.394; 54 1.245,4.394; 55 0.762,4.394; 56 0.254,4.394; 57 -0.254,4.394; 58 -0.762,4.394; 59 -1.245,4.394; 60 -1.753,4.394; 61 -2.261,4.394; 62 -2.743,4.394; 63 -3.251,4.394; 64 -3.759,4.394 | smd 7.391 x 7.391: 65 0,0
QFN50P800X800X100-57N = smd 0.813 x 0.305: 1 -3.988,3.251; 2 -3.988,2.743; 3 -3.988,2.261; 4 -3.988,1.753; 5 -3.988,1.245; 6 -3.988,0.762; 7 -3.988,0.254; 8 -3.988,-0.254; 9 -3.988,-0.762; 10 -3.988,-1.245; 11 -3.988,-1.753; 12 -3.988,-2.261; 13 -3.988,-2.743; 14 -3.988,-3.251; 29 3.988,-3.251; 30 3.988,-2.743; 31 3.988,-2.261; 32 3.988,-1.753; 33 3.988,-1.245; 34 3.988,-0.762; 35 3.988,-0.254; 36 3.988,0.254; 37 3.988,0.762; 38 3.988,1.245; 39 3.988,1.753; 40 3.988,2.261; 41 3.988,2.743; 42 3.988,3.251 | smd 0.305 x 0.813: 15 -3.251,-3.988; 16 -2.743,-3.988; 17 -2.261,-3.988; 18 -1.753,-3.988; 19 -1.245,-3.988; 20 -0.762,-3.988; 21 -0.254,-3.988; 22 0.254,-3.988; 23 0.762,-3.988; 24 1.245,-3.988; 25 1.753,-3.988; 26 2.261,-3.988; 27 2.743,-3.988; 28 3.251,-3.988; 43 3.251,3.988; 44 2.743,3.988; 45 2.261,3.988; 46 1.753,3.988; 47 1.245,3.988; 48 0.762,3.988; 49 0.254,3.988; 50 -0.254,3.988; 51 -0.762,3.988; 52 -1.245,3.988; 53 -1.753,3.988; 54 -2.261,3.988; 55 -2.743,3.988; 56 -3.251,3.988 | smd 5.994 x 5.994: 57 0,0
D2PAK-3 = smd 1.016 x 3.05: 1 -2.54,-11.31; 3 2.54,-11.31 | smd 10.66 x 8.38: 4 0,0
PN61729-S = drill 0.95 octagon: 1 1.25,4.71; 2 -1.25,4.71; 3 -1.25,2.71; 4 1.25,2.71 | drill 2.3 pad 2.9: S1 -6.02,0; S2 6.02,0

### Placement (x,y rotation side)
C1  37,61.75 0 top
C2  37.25,65.75 0 top
C3  37.5,63.25 180 top
C4  38.25,60.75 90 top
C5  53,39 270 bottom
C6  47,9 270 top
C7  -2,-3 0 top
C8  -2,-17 0 top  (outside the outline)
C9  61,23 270 top
C10  69,59 0 top
C11  67.5,23 270 top
C12  69,56 0 top
C13  82,31 0 top
C14  82,34 0 top
C15  51,31 180 top
C16  51,33 180 top
C17  51,35.5 180 top
C18  63,54 0 top
C19  63,51 0 top
C20  63,57 0 top
C21  63,60 0 top
C22  59,57 180 top
C23  59,54 180 top
C24  59,51 180 top
C25  59,48 180 top
C26  55,57 180 top
C27  55,54 180 top
C28  55,51 180 top
C29  55,48 180 top
C30  47,39 270 top
C31  49.5,39 270 top
C32  52,39 270 top
C33  54.5,39 270 top
C34  51,27 180 top
C35  57,19 180 top
C36  51,19 0 top
C37  51,33 0 bottom
C38  51,35.5 0 bottom
C39  51,29 0 top
C40  70,62 270 top
C41  68,62 270 top
C42  57,10 180 top
C43  85,16 180 top
C44  83,42 90 bottom
C45  86,42 90 bottom
C46  61,25 90 bottom
C47  66,25 90 bottom
C48  68.5,25 90 bottom
C49  72,25 90 bottom
C50  74.5,25 90 bottom
C51  77,25 90 bottom
C52  86,47 270 bottom
C53  80,47 270 bottom
C54  -2,-24 0 top  (outside the outline)
C55  -2,-31 0 top  (outside the outline)
C56  -2,-38 0 top  (outside the outline)
C57  -2,-45 0 top  (outside the outline)
C58  -2,-52 0 top  (outside the outline)
C59  -5,-59 0 top  (outside the outline)
C60  -5,-66 0 top  (outside the outline)
C61  -5,-73 0 top  (outside the outline)
C62  -5,-80 0 top  (outside the outline)
C63  -5,-87 0 top  (outside the outline)
C64  -5,-94 0 top  (outside the outline)
C65  -5,-101 0 top  (outside the outline)
C66  -5,-108 0 top  (outside the outline)
C67  -8,-115 0 top  (outside the outline)
C68  -8,-122 0 top  (outside the outline)
C69  -8,-191 0 top  (outside the outline)
C70  -8,-198 0 top  (outside the outline)
C71  -8,-205 0 top  (outside the outline)
C72  -8,-212 0 top  (outside the outline)
C73  -8,-219 0 top  (outside the outline)
D1  46,30 90 top
J1  34,62 0 top
JP1  44,17 270 top
L1  -6,-53 0 top  (outside the outline)
L2  49,51 90 top
L3  66,62 270 top
L4  -9,-109 0 top  (outside the outline)
LED1  -8,-225 0 top  (outside the outline)
Q1  54,22.75 0 top
R1  49,38 180 bottom
R2  49,41 180 bottom
R3  53,9 90 top
R4  50,9 90 top
R5  -2,-10 0 top  (outside the outline)
R6  -8,-149 0 top  (outside the outline)
R7  69,53 180 top
R8  74,65 180 top
R9  76,51 180 top
R10  76,53 180 top
R11  74,61 180 top
R12  74,63 0 top
R13  57,16 180 top
R14  57,13 180 top
R15  57,7 0 top
R16  77,47 270 bottom
R17  83,47 270 bottom
R18  63.5,25 270 bottom
R19  65.5,23 270 top
R20  76,12 90 bottom
R21  73,12 90 bottom
R22  67,12 90 bottom
R23  61,12 90 bottom
R24  82,12 90 bottom
R25  79,12 90 bottom
R26  70,12 90 bottom
R27  64,12 90 bottom
R28  -8,-156 0 top  (outside the outline)
R29  -8,-163 0 top  (outside the outline)
R30  -8,-170 0 top  (outside the outline)
R31  -8,-177 0 top  (outside the outline)
R32  -8,-184 0 top  (outside the outline)
R33  -8,-229 0 top  (outside the outline)
RJ1  1,-135 0 top  (outside the outline)
S1  40.75,37 270 top
S2  37,8.25 0 top
SD/MMC1  88,58 0 top
SW1  90,8 270 top
T1  52,14 0 top
T2  48.25,14 0 top
U1  68,35 0 top
U2  67,35 0 bottom
U3  71,12 0 top
U4  9.25,20 0 top
U5  8.25,43.25 0 top
U$1  27,64.25 90 top
X1  12.75,61.5 270 top

### Tracks (layer width: path | path; a pad name or v marks a point on that pad's centre or on a via)
1V2
  Top 0.254: C9.1 61.8,24.75 U1.1 61.8,28.3 62.25,28.75 62.25,35 63,35.75 U1.93 63,48 65.5,50.5 65.5,56.45 C10.1
3V3  (via drill 0.3)  (14 unrouted)
  Top 0.254: 56.05,11.5 R14.2 R13.2 | 56.05,11.5 C42.2 56.05,9.8 54.5,8.25 54.5,7 53.5,6 40.26,6 S2.4 S2.3 | 56.05,11.5 59.25,11.5 60,12.25 U3.12 63.25,12.25 66,15 v66,20.5 66,21.55 R19.2 66,22.05 | R8.2 71.5,65 | 71.5,65 68,65 L3.1 | R11.2 72.25,61 v71.75,61.5 71.5,61.75 71.5,65 | R9.2 R10.2 v73.75,53 | v71.75,57.5 69.55,57.5 C12.1 66,53.95 66,50.25 63.4,47.65 U1.92 63.4,35.4 62.75,34.75 62.75,32.75 64.25,31.25 65.5,31.25 68.6,28.15 U1.18 68.6,25.05 C11.1 66,22.45 66,22.05 | 66,22.05 66.1,22.05 | U3.37 82.5,12.25 84.05,13.8 | 84.05,13.8 C43.2 84,16.05 v84,19.75 | SW1.8 91.82,13.8 84.05,13.8
  Bottom 0.254: SW1.5 SW1.6 SW1.7 SW1.8 | v71.75,61.5 v71.75,57.5 73.75,55.5 v73.75,53 | v66,20.5 66.25,20.75 71.5,20.75 72.25,21.5 82.25,21.5 v84,19.75
5V0  (5 unrouted)
  Top 0.254: U1.102 58.7,39.2 58,38.5 56.75,38.5 56,39.25 56,40.5 55.25,41.25 46.25,41.25
AUART1_RX  (via drill 0.3)
  Top 0.254: v58,25 58.75,25.75 58.75,28.75 58.8,28.8 U1.128
  Bottom 0.254: JP1.4 47,17.46 47,21 50.25,24.25 57.25,24.25 v58,25
AUART1_TX  (via drill 0.3)
  Top 0.254: U1.127 58.45,29.2 58.25,29 58.25,26.25 v57,25
  Bottom 0.254: v57,25 56.75,24.75 50,24.75 46.5,21.25 46.5,19.5 JP1.3
DCDC_BATTERY  (via drill 0.3)
  Top 0.254: C30.1 48.25,39.95 | 48.25,39.95 C31.1 C32.1 C33.1 55.3,39.95 55.5,39.75 55.5,38.75 v56.25,38 58.25,38 59.05,38.8 U1.103 | U1.100 57.25,40 v56.75,39.5 | D1.A 48.25,36.06 48.25,39.95
  Bottom 0.254: v56.75,39.5 56.75,38.5 v56.25,38
DCDC_VDDA  (via drill 0.3)
  Top 0.254: v58,34.75 59.25,36 U1.110 61.25,36 61.5,36.25 61.5,37.5 61.8,37.8 U1.96 61.8,44.45 61,45.25 61,46.25 60.5,46.75 57,46.75 55.95,47.8 C29.1 C28.1 C27.1 C26.1 | v55.75,34.75 v53.75,34.75
  Bottom 0.254: v58,34.75 v55.75,34.75 | v53.75,34.75 52.7,34.75 C38.1 C37.1
DCDC_VDDD
  Top 0.254: U1.94 62.6,45.15 62.05,45.7 C19.1 C18.1 C20.1 C21.1
DCDC_VDDIO
  Top 0.254: U1.95 62.2,44.8 61.5,45.5 61.5,46.45 C25.1 C24.1 C23.1 C22.1
DEBUG
  Top 0.254: U1.89 64.6,47.35 67,49.75 67,51.95 R7.2
DUART_RX  (via drill 0.3)
  Top 0.254: U1.125 57.75,30 57.25,29.5 57.25,27.25 56,26 v55,26
  Bottom 0.254: v55,26 49.5,26 45.58,22.08 JP1.1
DUART_TX  (via drill 0.3)
  Top 0.254: v57.25,26.25 57.75,26.75 57.75,29.25 58.1,29.6 U1.126
  Bottom 0.254: JP1.2 44.04,19.54 49.75,25.25 56.25,25.25 v57.25,26.25
EMI_A00  (via drill 0.3)
  Top 0.254: U1.76 69.8,35.55 v69.5,35.25
  Bottom 0.254: U2.29 59.2,30.2 64,35 69.25,35 v69.5,35.25
EMI_A01  (via drill 0.3)
  Top 0.254: U1.75 70.2,35.55 v70.5,35.25
  Bottom 0.254: v70.5,35.25 69.75,36 69.25,36 68.75,35.5 63.75,35.5 58.55,30.3 U2.30
EMI_A02  (via drill 0.3)
  Top 0.254: U1.74 70.6,36.15 v71.5,35.25
  Bottom 0.254: v71.5,35.25 70.25,36.5 69,36.5 68.5,36 63.5,36 57.9,30.4 U2.31
EMI_A03  (via drill 0.3)
  Top 0.254: U1.73 71,36.75 v71.25,36.5
  Bottom 0.254: v71.25,36.5 70.75,37 68.75,37 68.25,36.5 63.25,36.5 57.25,30.5 U2.32
EMI_A04  (via drill 0.3)
  Top 0.254: v70.5,48.25 70.5,44.75 71.4,43.85 U1.72
  Bottom 0.254: U2.35 57.25,44 61.25,48 70.25,48 v70.5,48.25
EMI_A05  (via drill 0.3)
  Top 0.254: v71.5,48 71.25,47.75 71.25,44.75 71.8,44.2 U1.71
  Bottom 0.254: U2.36 57.9,43.9 61.5,47.5 71,47.5 v71.5,48
EMI_A06  (via drill 0.3)
  Top 0.254: U1.70 72.2,44.55 71.75,45 71.75,47.25 72.5,48 v73,48
  Bottom 0.254: U2.37 58.55,43.8 61.75,47 71.5,47 72.5,48 v73,48
EMI_A07  (via drill 0.3)
  Top 0.254: v72.5,47 72.25,46.75 72.25,45.25 72.6,44.9 U1.69
  Bottom 0.254: U2.38 59.2,43.7 62,46.5 72,46.5 v72.5,47
EMI_A08  (via drill 0.3)
  Top 0.254: v73.5,47 72.75,46.25 72.75,45.5 73,45.25 U1.68
  Bottom 0.254: U2.39 59.85,43.6 62.25,46 72.5,46 v73.5,47
EMI_A09  (via drill 0.3)
  Top 0.254: v73.5,46 73.4,45.9 U1.67
  Bottom 0.254: U2.40 60.5,43.5 62.5,45.5 73,45.5 v73.5,46
EMI_A10  (via drill 0.3)
  Top 0.254: v73.25,38.5 73.25,40 73.8,40.55 U1.66
  Bottom 0.254: v73.25,38.5 75.25,36.5 75.25,35.75 74,34.5 64.25,34.5 59.85,30.1 U2.28
EMI_A11  (via drill 0.3)
  Top 0.254: v74.5,45.75 74.2,45.45 U1.65
  Bottom 0.254: U2.41 61.15,43.4 62.75,45 73.75,45 v74.5,45.75
EMI_A12  (via drill 0.3)
  Top 0.254: v80,40.75 79.55,41.2 U1.64
  Bottom 0.254: U2.42 61.8,43.05 63.25,44.5 79,44.5 79.75,43.75 79.75,41 v80,40.75
EMI_BA0  (via drill 0.3)
  Top 0.254: U1.79 68.6,38.6 67.5,37.5 67.5,35.25 v66,33.75
  Bottom 0.254: U2.26 61.15,29.9 64.25,33 65.25,33 v66,33.75
EMI_BA1  (via drill 0.3)
  Top 0.254: U1.80 68.2,38.95 67,37.75 67,35.75 v65,33.75
  Bottom 0.254: U2.27 60.5,30 64.25,33.75 v65,33.75
EMI_CASN  (via drill 0.3)
  Top 0.254: U1.61 78.25,40 79,39.25 79,34.75 v78.5,34.25
  Bottom 0.254: U2.22 63.75,30.25 65,31.5 66.25,31.5 67.75,33 74.75,33 76.75,35 77.75,35 v78.5,34.25
EMI_CE0N  (via drill 0.3)
  Top 0.254: v80.25,35.5 80.25,39.5 78.95,40.8 U1.63
  Bottom 0.254: R18.1 62.45,27 U2.24 62.45,30.45 64.5,32.5 65.75,32.5 67.25,34 74.25,34 76.25,36 79.75,36 v80.25,35.5
EMI_CKE  (via drill 0.3)
  Top 0.254: U1.78 69,38 v68.75,37.75
  Bottom 0.254: v68.75,37.75 68,37 65.5,37 64.5,38 64.5,38.5 63.1,39.9 U2.44
EMI_CLK  (via drill 0.3)
  Top 0.254: U1.36 74.25,30 73.25,29 68.5,29 65.75,31.75 64.5,31.75 63.25,33 63.25,34.5 65.25,36.5 v65.25,38.25
  Bottom 0.254: U2.45 63.75,40 65.25,38.5 v65.25,38.25
EMI_CLKN  (via drill 0.3)
  Top 0.254: U1.37 73.9,30.4 73,29.5 68.75,29.5 66,32.25 64.75,32.25 63.75,33.25 63.75,34.25 66,36.5 66,38.5 66.25,38.75 v66.25,39
  Bottom 0.254: U2.46 64.4,40.1 65.5,39 v66.25,39
EMI_D00  (via drill 0.3)
  Top 0.254: U1.41 77,32 77.75,31.25 78.25,31.25 78.75,31.75 79.5,31.75 v79.75,31.5
  Bottom 0.254: U2.2 76.75,29.75 77.25,30.25 79.25,30.25 79.75,30.75 v79.75,31.5
EMI_D01  (via drill 0.3)
  Top 0.254: U1.43 78.45,32.8 v78.75,32.5
  Bottom 0.254: U2.4 75.45,30.2 76.5,31.25 78.25,31.25 78.75,31.75 v78.75,32.5
EMI_D02  (via drill 0.3)
  Top 0.254: U1.42 77.6,32.4 v78,32
  Bottom 0.254: U2.5 74.8,30.3 76.25,31.75 77.75,31.75 v78,32
EMI_D03  (via drill 0.3)
  Top 0.254: U1.44 73.45,33.2 73,32.75 v73,31.25
  Bottom 0.254: v73,31.25 73.5,30.75 U2.7
EMI_D04  (via drill 0.3)
  Top 0.254: U1.47 73.9,34.4 72,32.5 v72,31
  Bottom 0.254: U2.8 72.85,30.15 v72,31
EMI_D05  (via drill 0.3)
  Top 0.254: U1.48 73.55,34.8 71,32.25 v71,30.75
  Bottom 0.254: U2.10 71.55,30.2 v71,30.75
EMI_D06  (via drill 0.3)
  Top 0.254: U1.49 73.2,35.2 70.25,32.25 v70.25,31.25
  Bottom 0.254: U2.11 70.9,29.85 70.25,30.5 v70.25,31.25
EMI_D07  (via drill 0.3)
  Top 0.254: U1.50 72.85,35.6 69.5,32.25 v69.5,30.75
  Bottom 0.254: U2.13 69.6,30.9 v69.5,30.75
EMI_D08  (via drill 0.3)
  Top 0.254: U1.51 v72,36
  Bottom 0.254: U2.54 69.6,39.15 72,36.75 v72,36
EMI_D09  (via drill 0.3)
  Top 0.254: U1.52 73.1,36.4 v72.75,36.75
  Bottom 0.254: U2.56 70.9,38.6 v72.75,36.75
EMI_D10  (via drill 0.3)
  Top 0.254: U1.54 74.05,37.2 v73.75,37
  Bottom 0.254: U2.57 71.55,38.95 73.5,37 v73.75,37
EMI_D11  (via drill 0.3)
  Top 0.254: U1.55 73.15,37.6 72.25,38.5 v72.25,39.5
  Bottom 0.254: v72.25,39.5 72.85,40.1 U2.59
EMI_D12  (via drill 0.3)
  Top 0.254: U1.57 74.35,38.4 v74.25,38.5
  Bottom 0.254: v74.25,38.5 73.5,39.25 U2.60
EMI_D13  (via drill 0.3)
  Top 0.254: U1.58 74.95,38.8 v74.25,39.5
  Bottom 0.254: v74.25,39.5 74.8,40.05 U2.62
EMI_D14  (via drill 0.3)
  Top 0.254: U1.60 77.9,39.6 78.25,39.25 v78.25,38.25
  Bottom 0.254: U2.63 75.45,39.8 77,38.25 v78.25,38.25
EMI_D15  (via drill 0.3)
  Top 0.254: U1.59 77.05,39.2 v77.25,39
  Bottom 0.254: U2.65 76.75,39.5 v77.25,39
EMI_DQM0  (via drill 0.3)
  Top 0.254: U1.46 77,34 v77.25,34.25
  Bottom 0.254: v77.25,34.25 75.5,32.5 69.25,32.5 67.25,30.5 65.5,30.5 65.05,30.05 U2.20
EMI_DQM1  (via drill 0.3)
  Top 0.254: U1.56 76.75,38 v77.25,37.5
  Bottom 0.254: U2.47 65.05,42.05 65.5,42.5 69.5,42.5 71,44 78.75,44 79.25,43.5 79.25,38 78.75,37.5 v77.25,37.5
EMI_DQS0  (via drill 0.3)
  Top 0.254: U1.39 74.7,31.2 v74.5,31
  Bottom 0.254: v74.5,31 73.5,32 69.5,32 67.65,30.15 U2.16
EMI_DQS1  (via drill 0.3)
  Top 0.254: v67.25,39 66.5,38.25 66.5,36.25 64.25,34 64.25,33.5 65,32.75 66.25,32.75 69,30 72.75,30 73.75,31 73.75,31.25 74.1,31.6 U1.40
  Bottom 0.254: v67.25,39 67.65,39.4 U2.51
EMI_RASN  (via drill 0.3)
  Top 0.254: U1.62 78.6,40.4 79.5,39.5 v79.5,34.25
  Bottom 0.254: U2.23 63.1,30.35 64.75,32 66,32 67.5,33.5 74.5,33.5 76.5,35.5 78.25,35.5 v79.5,34.25
EMI_WEN  (via drill 0.3)
  Top 0.254: U1.77 69.4,37.15 68,35.75 v68,32.25
  Bottom 0.254: U2.21 64.4,30.15 65.25,31 66.75,31 v68,32.25
GND  (115 unrouted)
GPMI_ALE
  Top 0.254: U3.17 62.25,9.75 67,14.5 67,18.75 69.4,21.15 U1.20
GPMI_CE0N  (via drill 0.3)
  Top 0.254: U3.9 v59.5,13.75 58.7,13.75 R14.1 | U1.82 67.4,41.4 64.25,38.25 v64.25,37.25 | v62.25,37.25 62.25,35.75 61.75,35.25 61.75,28.75 59.5,26.5 v59.5,16
  Bottom 0.254: v64.25,37.25 v62.25,37.25 | v59.5,16 v59.5,13.75
GPMI_CLE
  Top 0.254: U3.16 62,10.25 66.5,14.75 66.5,19 69,21.5 U1.19
GPMI_D00
  Top 0.254: U1.22 70.2,11.55 73.5,8.25 U3.29
GPMI_D01
  Top 0.254: U1.23 70.6,11.9 73.75,8.75 U3.30
GPMI_D02
  Top 0.254: U1.24 71,12.25 74,9.25 U3.31
GPMI_D03
  Top 0.254: U1.25 71.4,12.6 74.25,9.75 U3.32
GPMI_D04  (via drill 0.3)
  Top 0.254: U1.27 72.2,17.55 v72.5,17.25 | v72.25,15.5 73.5,14.25 U3.41
  Bottom 0.254: v72.25,15.5 72.25,17 v72.5,17.25
GPMI_D05
  Top 0.254: U1.26 71.8,16.95 74,14.75 U3.42
GPMI_D06  (via drill 0.3)
  Top 0.254: U1.29 73,19 v74.5,17.5 | U3.43 74.75,15.25 v74.5,15.5
  Bottom 0.254: v74.5,17.5 v74.5,15.5
GPMI_D07
  Top 0.254: U1.28 72.6,18.4 75.25,15.75 U3.44
GPMI_RDN  (via drill 0.3)
  Top 0.254: U3.8 64.5,14.25 65.5,15.25 65.5,17 v65.25,17.25 | U1.31 73.8,19.2 v74.25,18.75
  Bottom 0.254: v65.25,17.25 71.25,17.25 72.75,18.75 v74.25,18.75
GPMI_RDY0  (via drill 0.3)
  Top 0.254: R13.1 59.2,14.75 U3.7 64.25,14.75 65,15.5 65,16.5 64.5,17 64.5,17.75 v65,18.25 | U1.32 74.2,20.05 v75,19.25
  Bottom 0.254: v65,18.25 71.5,18.25 72.75,19.5 74.75,19.5 v75,19.25
GPMI_WPN  (via drill 0.3)
  Top 0.254: R15.2 59.7,8.75 U3.19 62.75,8.75 68,14 68,17.75 v69.25,19 | U1.34 76.8,29.2 78.25,27.75 78.25,22.5 75.75,20 v75.5,20
  Bottom 0.254: v69.25,19 71.5,19 72.5,20 v75.5,20
GPMI_WRN  (via drill 0.3)
  Top 0.254: U3.18 62.5,9.25 67.5,14.25 67.5,18.25 v69.25,20 | U1.33 76.45,28.8 77.75,27.5 77.75,23.25 75.25,20.75 v75,20.75
  Bottom 0.254: v69.25,20 71.75,20 72.25,20.5 74.75,20.5 v75,20.75
LCD_D00  (via drill 0.3)
  Top 0.254: U1.2 62.2,20.45 v61.25,19.5
  Bottom 0.254: 61.05,11 R23.2 | R23.2 R27.2 | v61.25,19.5 61,19.25 R23.2
LCD_D01  (via drill 0.3)
  Top 0.254: U1.3 62.6,19.85 v62.25,19.5
  Bottom 0.254: R26.2 R22.2 62.25,17.7 v62.25,19.5
LCD_D02  (via drill 0.3)
  Top 0.254: U1.4 63,20.5 v63.25,20.25
  Bottom 0.254: R25.2 78.05,12 73.95,12 R21.2 73,13 71.5,14.5 66.25,14.5 63.25,17.5 v63.25,20.25
LCD_D03  (via drill 0.3)
  Top 0.254: U1.5 63.4,21.1 64,20.5 v64,19.5
  Bottom 0.254: v64,19.5 64,17.5 66.5,15 71.75,15 72.5,14.25 74.7,14.25 | 74.7,14.25 R20.2 | R24.2 80.7,14.25 74.7,14.25
N$1  (2 unrouted)
N$2
  Top 0.254: R3.1 53,7.75 51.75,6.5 44.26,6.5 S2.2 S2.1
N$3
  Bottom 0.254: R1.1 R2.1 43.76,41 S1.1 S1.2
N$4
  Top 0.254: T1.1 51.05,11 R4.2 | R4.2 R3.2 | R4.2 C6.1
N$5
  Bottom 0.254: SW1.1 85.81,11.81 83.25,9.25 77.8,9.25 R20.1
N$6
  Bottom 0.254: SW1.2 85.67,8.75 75.3,8.75 R21.1
N$7
  Bottom 0.254: SW1.3 84.67,8.25 69.8,8.25 R22.1
N$8
  Bottom 0.254: SW1.4 82.63,7.75 64.3,7.75 R23.1
N$9
  Top 0.254: L2.2 49.25,54 52,51.25 52,46 56.8,41.2 U1.97
N$10  (1 unrouted)
N$11
  Top 0.254: 49,47.75 L2.1 49.25,48 56.85,40.4 U1.99
N$12
  Top 0.254: U1.117 57.3,33.2 57,33.5 56.5,33.5 53.75,30.75 53.75,29.25 53.5,29 C39.2
N$13
  Top 0.254: R19.1 67,25.45 U1.14
N$14  (1 unrouted)
N$16
  Top 0.254: SD/MMC1.4 79.8,56.95 77.25,59.5 71.55,59.5 C40.2 C41.2 66.05,61.05 L3.2
N$17  (3 unrouted)
N$18  (1 unrouted)
N$26  (via drill 0.3)
  Top 0.254: v74.75,47 v78.5,43.25
  Bottom 0.254: U2.49 66.35,41.85 66.5,42 69.75,42 71.25,43.5 78.25,43.5 v78.5,43.25 | v74.75,47 75.7,46.05 R16.2 C53.2 80.55,46.05 82.25,47.75 82.8,47.75 R17.1 C52.1
PSWITCH  (via drill 0.3)
  Top 0.254: U1.119 57.1,32.4 v56.75,32.75
  Bottom 0.254: v56.75,32.75 53,36.5 C5.1 51.95,41 R2.2
RXN  (3 unrouted)
RXP  (3 unrouted)
SSP1_CMD  (via drill 0.3)
  Top 0.254: SD/MMC1.3 79.7,58.05 76.75,61 R11.1 | U1.83 67,46 70,49 72,49 v72.25,48.75 | 80.67,58 SD/MMC1.3 | v82.25,58 82.2,58.05 SD/MMC1.3
  Bottom 0.254: v72.25,48.75 77.75,48.75 83.75,54.5 83.75,57 82.75,58 v82.25,58
SSP1_DATA0  (via drill 0.3)
  Top 0.254: U1.84 66.6,46.35 69.75,49.5 v73.25,49.5 | SD/MMC1.7 77.6,53.65 R10.1 76.95,53.55 76.25,54.25 73.75,54.25 72.5,53 v72.5,52.75
  Bottom 0.254: v72.5,52.75 72.5,49.75 72.75,49.5 v73.25,49.5
SSP1_DATA1
  Top 0.254: U1.85 66.2,46.7 69.75,50.25 73.75,50.25 74.25,49.75 76,49.75 76.75,50.5 76.75,50.8 R9.1 78.5,52.55 SD/MMC1.8
SSP1_DATA2  (via drill 0.3)
  Top 0.254: R8.1 79.7,60.25 SD/MMC1.1 82.25,60.25 83.75,58.75 83.75,55.75 v82.75,54.75 | U1.86 65.8,47.05 69.5,50.75 70.5,50.75 71.75,52 71.75,53 73.5,54.75 76.75,54.75 v77,54.5
  Bottom 0.254: v77,54.5 77.25,54.25 82.25,54.25 v82.75,54.75
SSP1_DATA3  (via drill 0.3)
  Top 0.254: R12.2 75.75,63 79.6,59.15 SD/MMC1.2 82.35,59.15 83,58.5 v83,56 | U1.87 65.4,47.4 69.25,51.25 70.25,51.25 71.25,52.25 71.25,53.25 73.25,55.25 77.75,55.25 v78,55
  Bottom 0.254: v78,55 82,55 v83,56
SSP1_SCK
  Top 0.254: U1.90 64.2,47.7 66.5,50 66.5,53.5 67.5,54.5 71.75,54.5 73.1,55.85 SD/MMC1.5
TXN  (3 unrouted)
TXP  (3 unrouted)
USB_DM  (via drill 0.3)  (1 unrouted)
  Top 0.254: U1.123 56.8,30.8 55.75,29.75 v55.75,26.75
  Bottom 0.254: v55.75,26.75 49.5,26.75 47,24.25
USB_DP  (via drill 0.3)  (1 unrouted)
  Top 0.254: U1.124 57.15,30.4 56.5,29.75 v56.5,27.5
  Bottom 0.254: 46.75,24.75 49.75,27.75 56.25,27.75 v56.5,27.5
VBUS_DET  (1 unrouted)
VDD3V3A  (20 unrouted)
VDD4P2  (via drill 0.3)
  Top 0.254: 52,35.05 C17.1 | C17.1 51.95,34.25 | 51.95,34.25 C16.1 | U1.101 58.1,39.6 v57.75,39.25 | v57.5,37.25 57.5,36 57,35.5 C17.1 | D1.C 46,31.5 48.75,34.25 51.95,34.25
  Bottom 0.254: v57.75,39.25 57.5,39 v57.5,37.25
VDD18CORE  (4 unrouted)
VDD18ETHPLL  (2 unrouted)
VDD18USBPLL  (2 unrouted)
VDD33IO  (1 unrouted)
VDDIO_DRAM  (via drill 0.3)
  Top 0.254: U1.45 81.05,33.6 C14.1 | v81,29.5 81.05,29.55 C13.1 C14.1 | v79,31 78.8,30.8 U1.38 | v81,36.25 81,34.05 C14.1 | U1.53 78.2,36.8 v78.25,36.75 | v78.5,42.25 80,42.25 v80.5,41.75
  Bottom 0.254: C51.2 77.4,26.35 U2.1 77.83,29.5 v81,29.5 | C51.2 76.1,26.85 U2.3 76.1,30.1 76.75,30.75 78.75,30.75 v79,31 | C47.2 C48.2 | C48.2 C49.2 | C49.2 C50.2 C51.2 | U2.9 72.2,26.15 C49.2 | U2.15 68.3,26.15 C48.2 | U2.18 66.35,26.3 C47.2 | U2.33 56.6,28.4 59,26 60.95,26 C46.2 61.3,25.95 63,24.25 63.3,24.25 R18.2 C47.2 | U2.55 70.25,41.75 71.5,43 74.15,43 | v78.25,36.75 80.5,36.75 v81,36.25 81,41.25 v80.5,41.75 81.7,42.95 C44.2 | 74.15,43 77.75,43 v78.5,42.25 | U2.61 74.15,43 | C52.2 R17.2 C44.2 | C44.2 C45.2
VDDM/LRADC4
  Top 0.254: C15.1 53.25,31 58,35.75 58,36.75 58.85,37.6 U1.106
VDDXTAL
  Top 0.254: U1.120 55.75,32 54.25,30.5 54.25,27.75 53.5,27 C34.1 49.7,24.75 45,24.75 38.49,31.26 S1.4
  Bottom 0.254: S1.3 S1.4
XTALI
  Top 0.254: T1.3 55.9,19 C35.2 56.54,19.49 Q1.2 56.5,22.75 54.25,25 54.25,26.25 55.25,27.25 55.25,30 56.45,31.2 U1.122
XTALO
  Top 0.254: T2.3 51.95,18.8 C36.2 51.46,19.49 Q1.1 51.46,24.21 54.75,27.5 54.75,30.25 56.1,31.6 U1.121